# EAGLE design trill.slim (EAGLE 8.4.0)
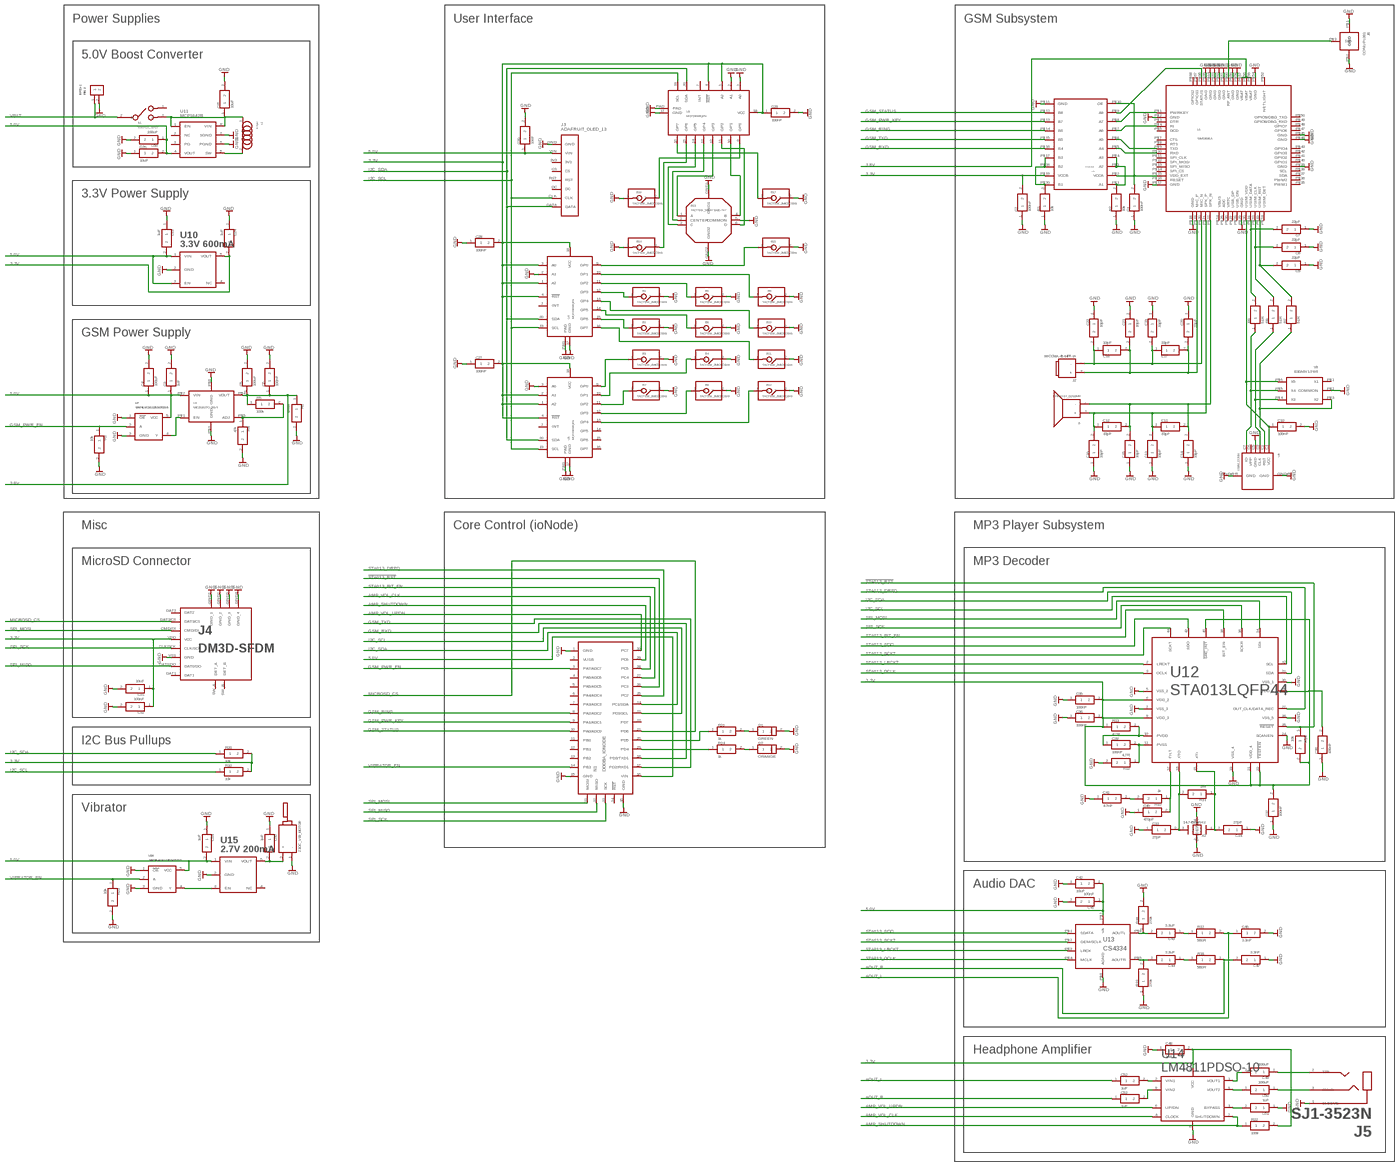
[diagram p0: schematic, sheet 1, overview]
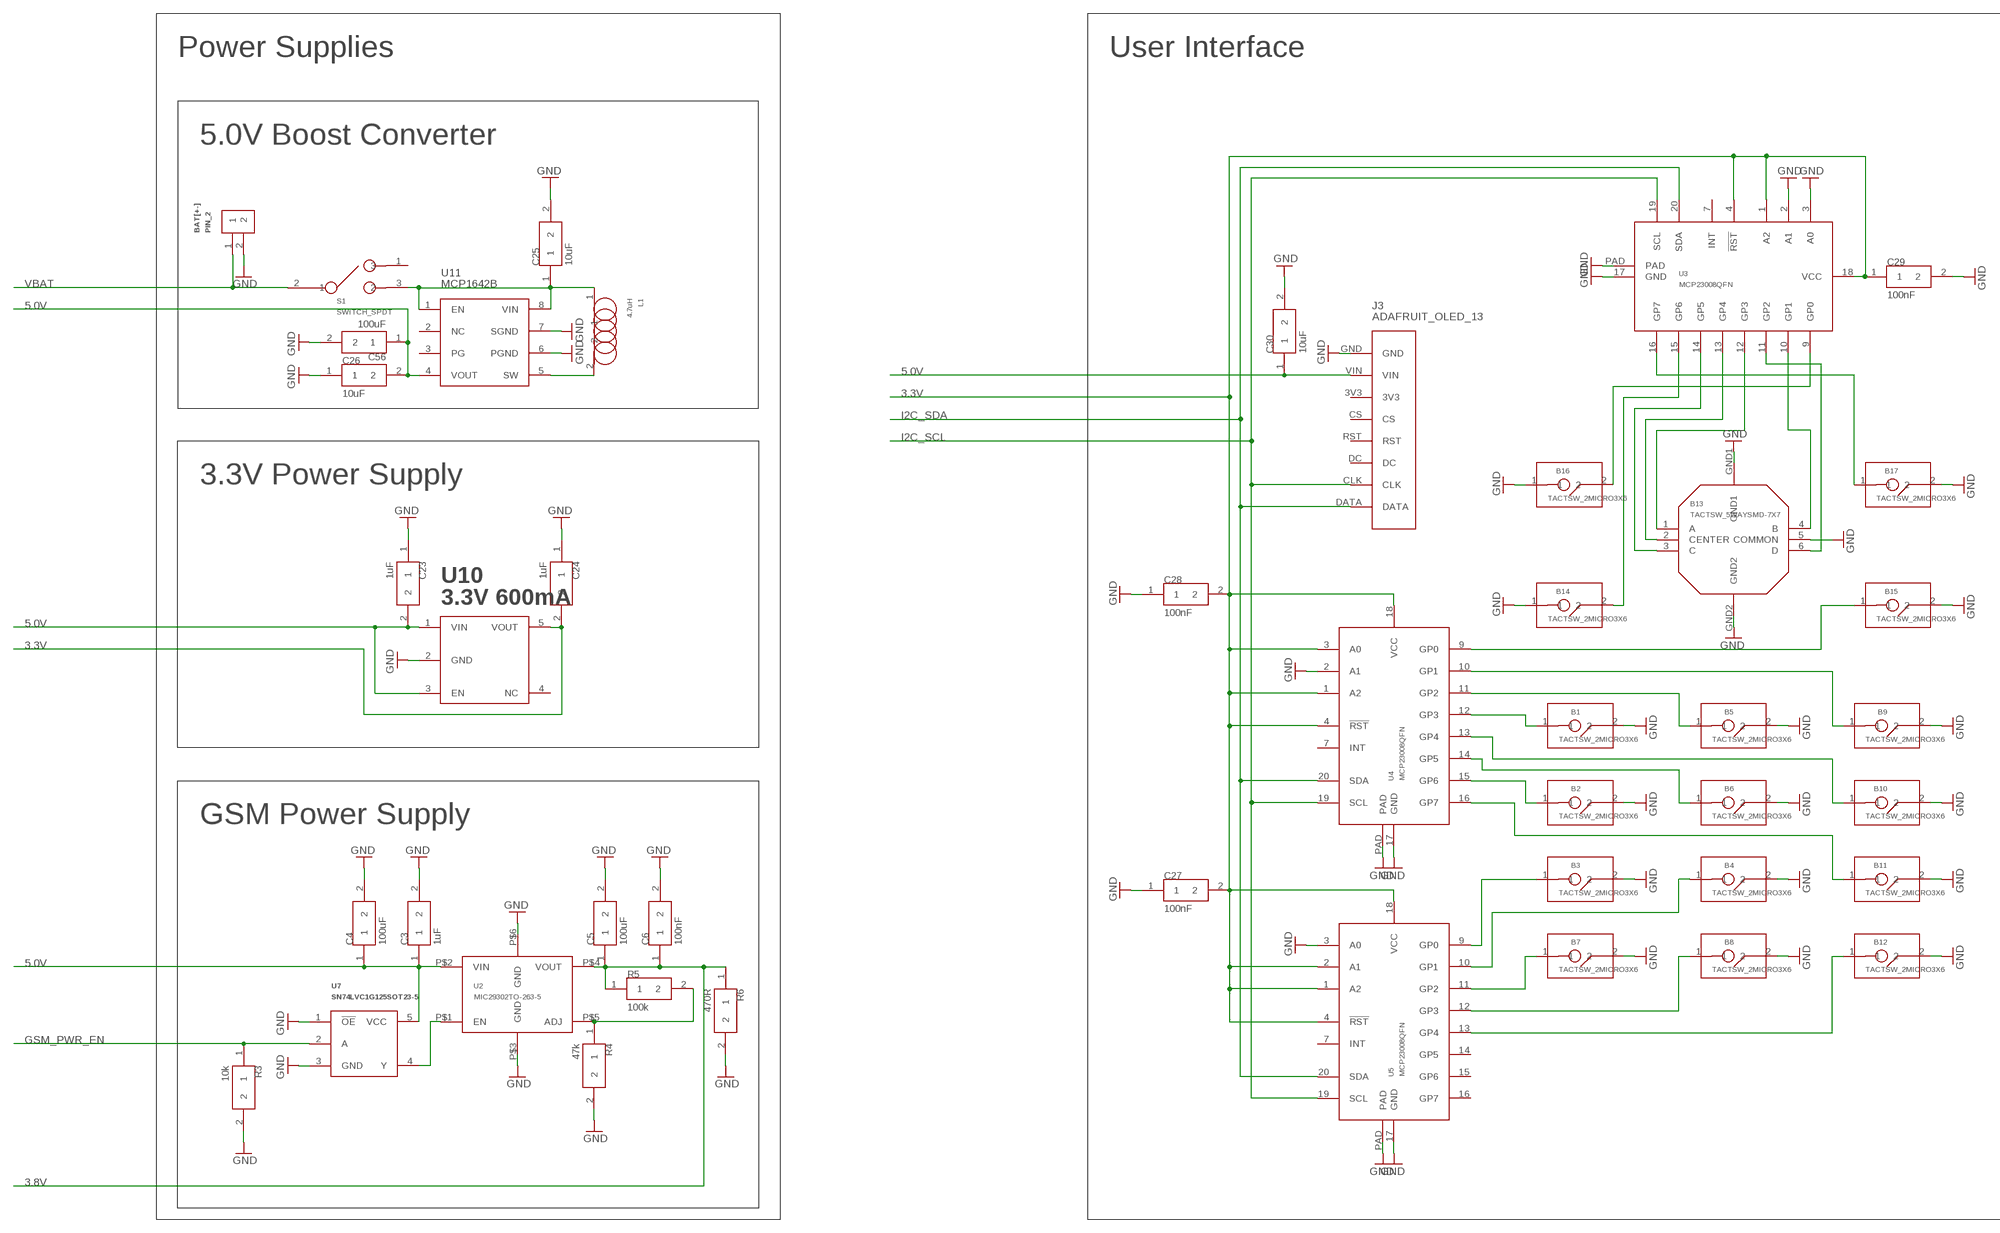
[diagram p1: schematic, sheet 1, part 1 of 4]
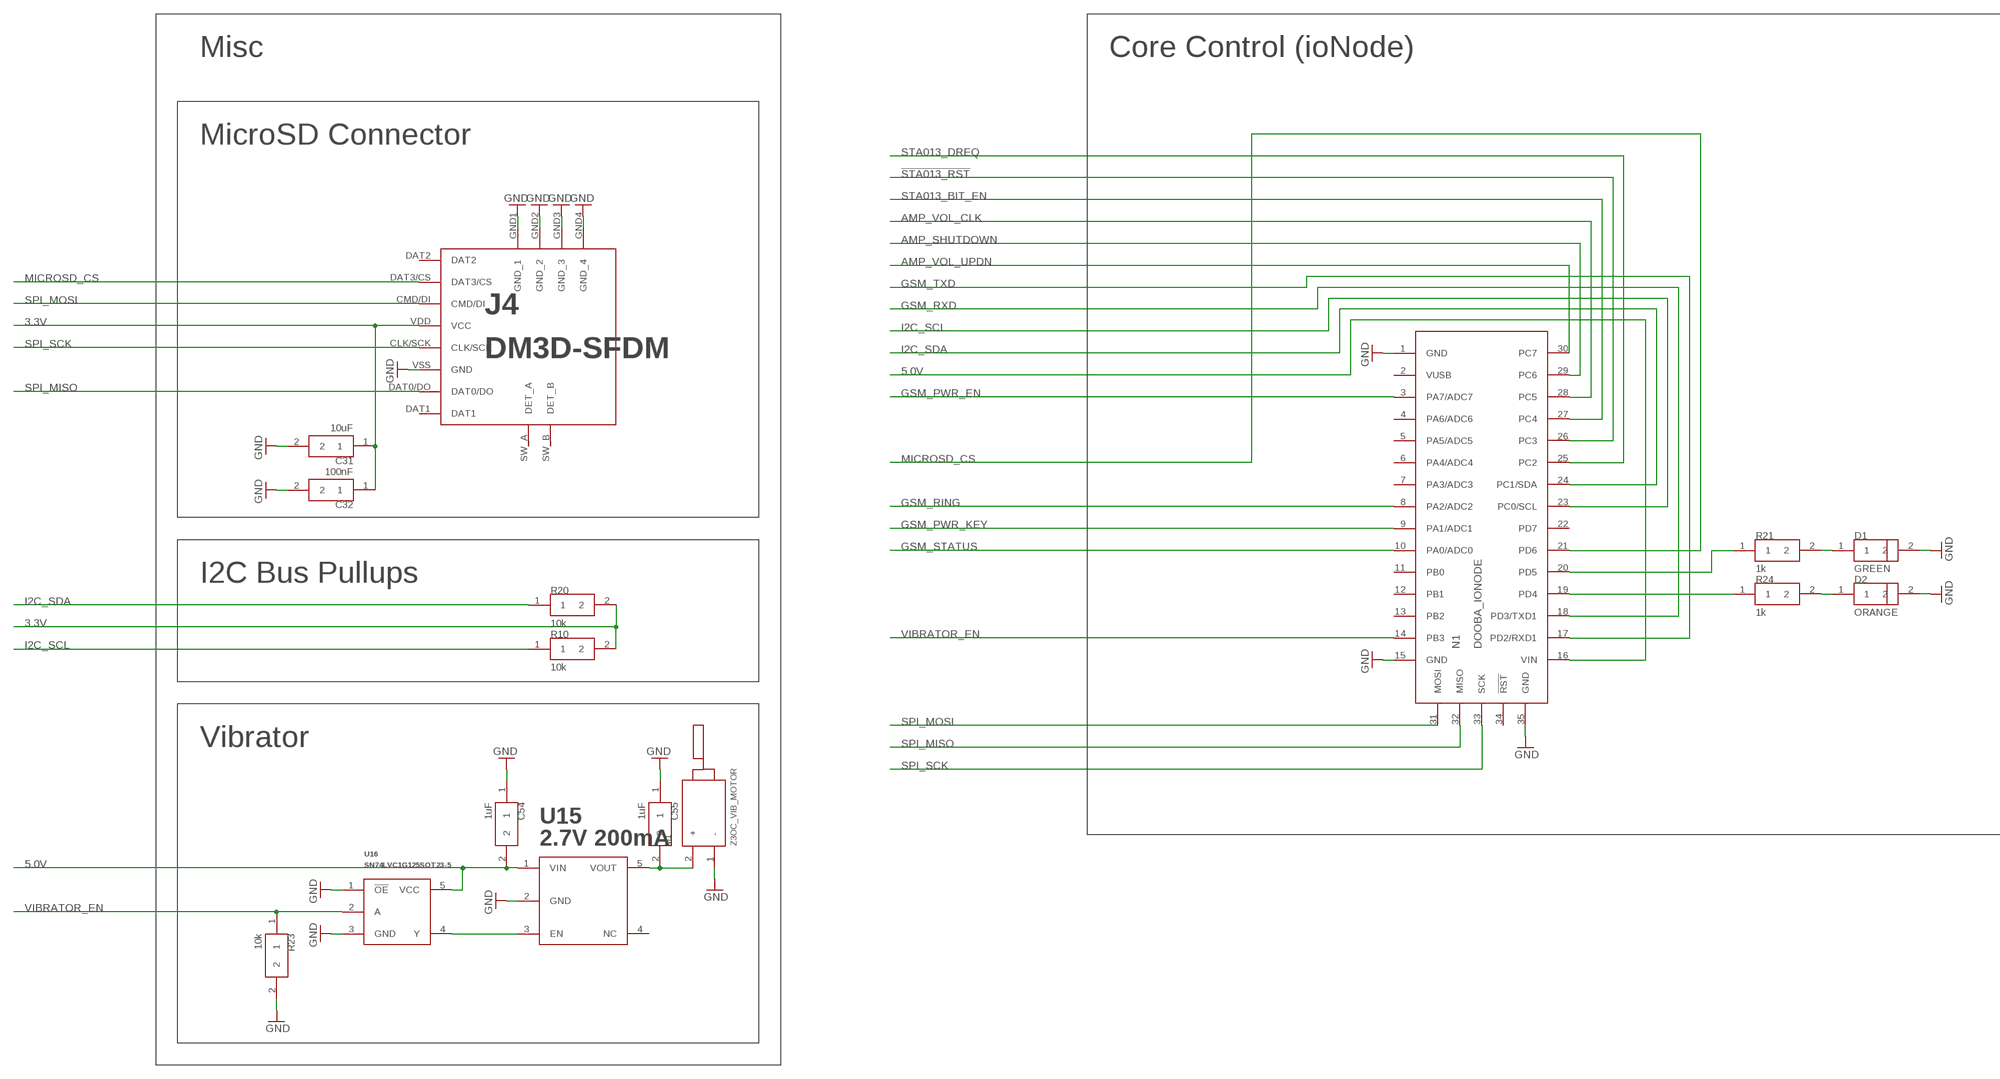
[diagram p2: schematic, sheet 1, part 2 of 4]
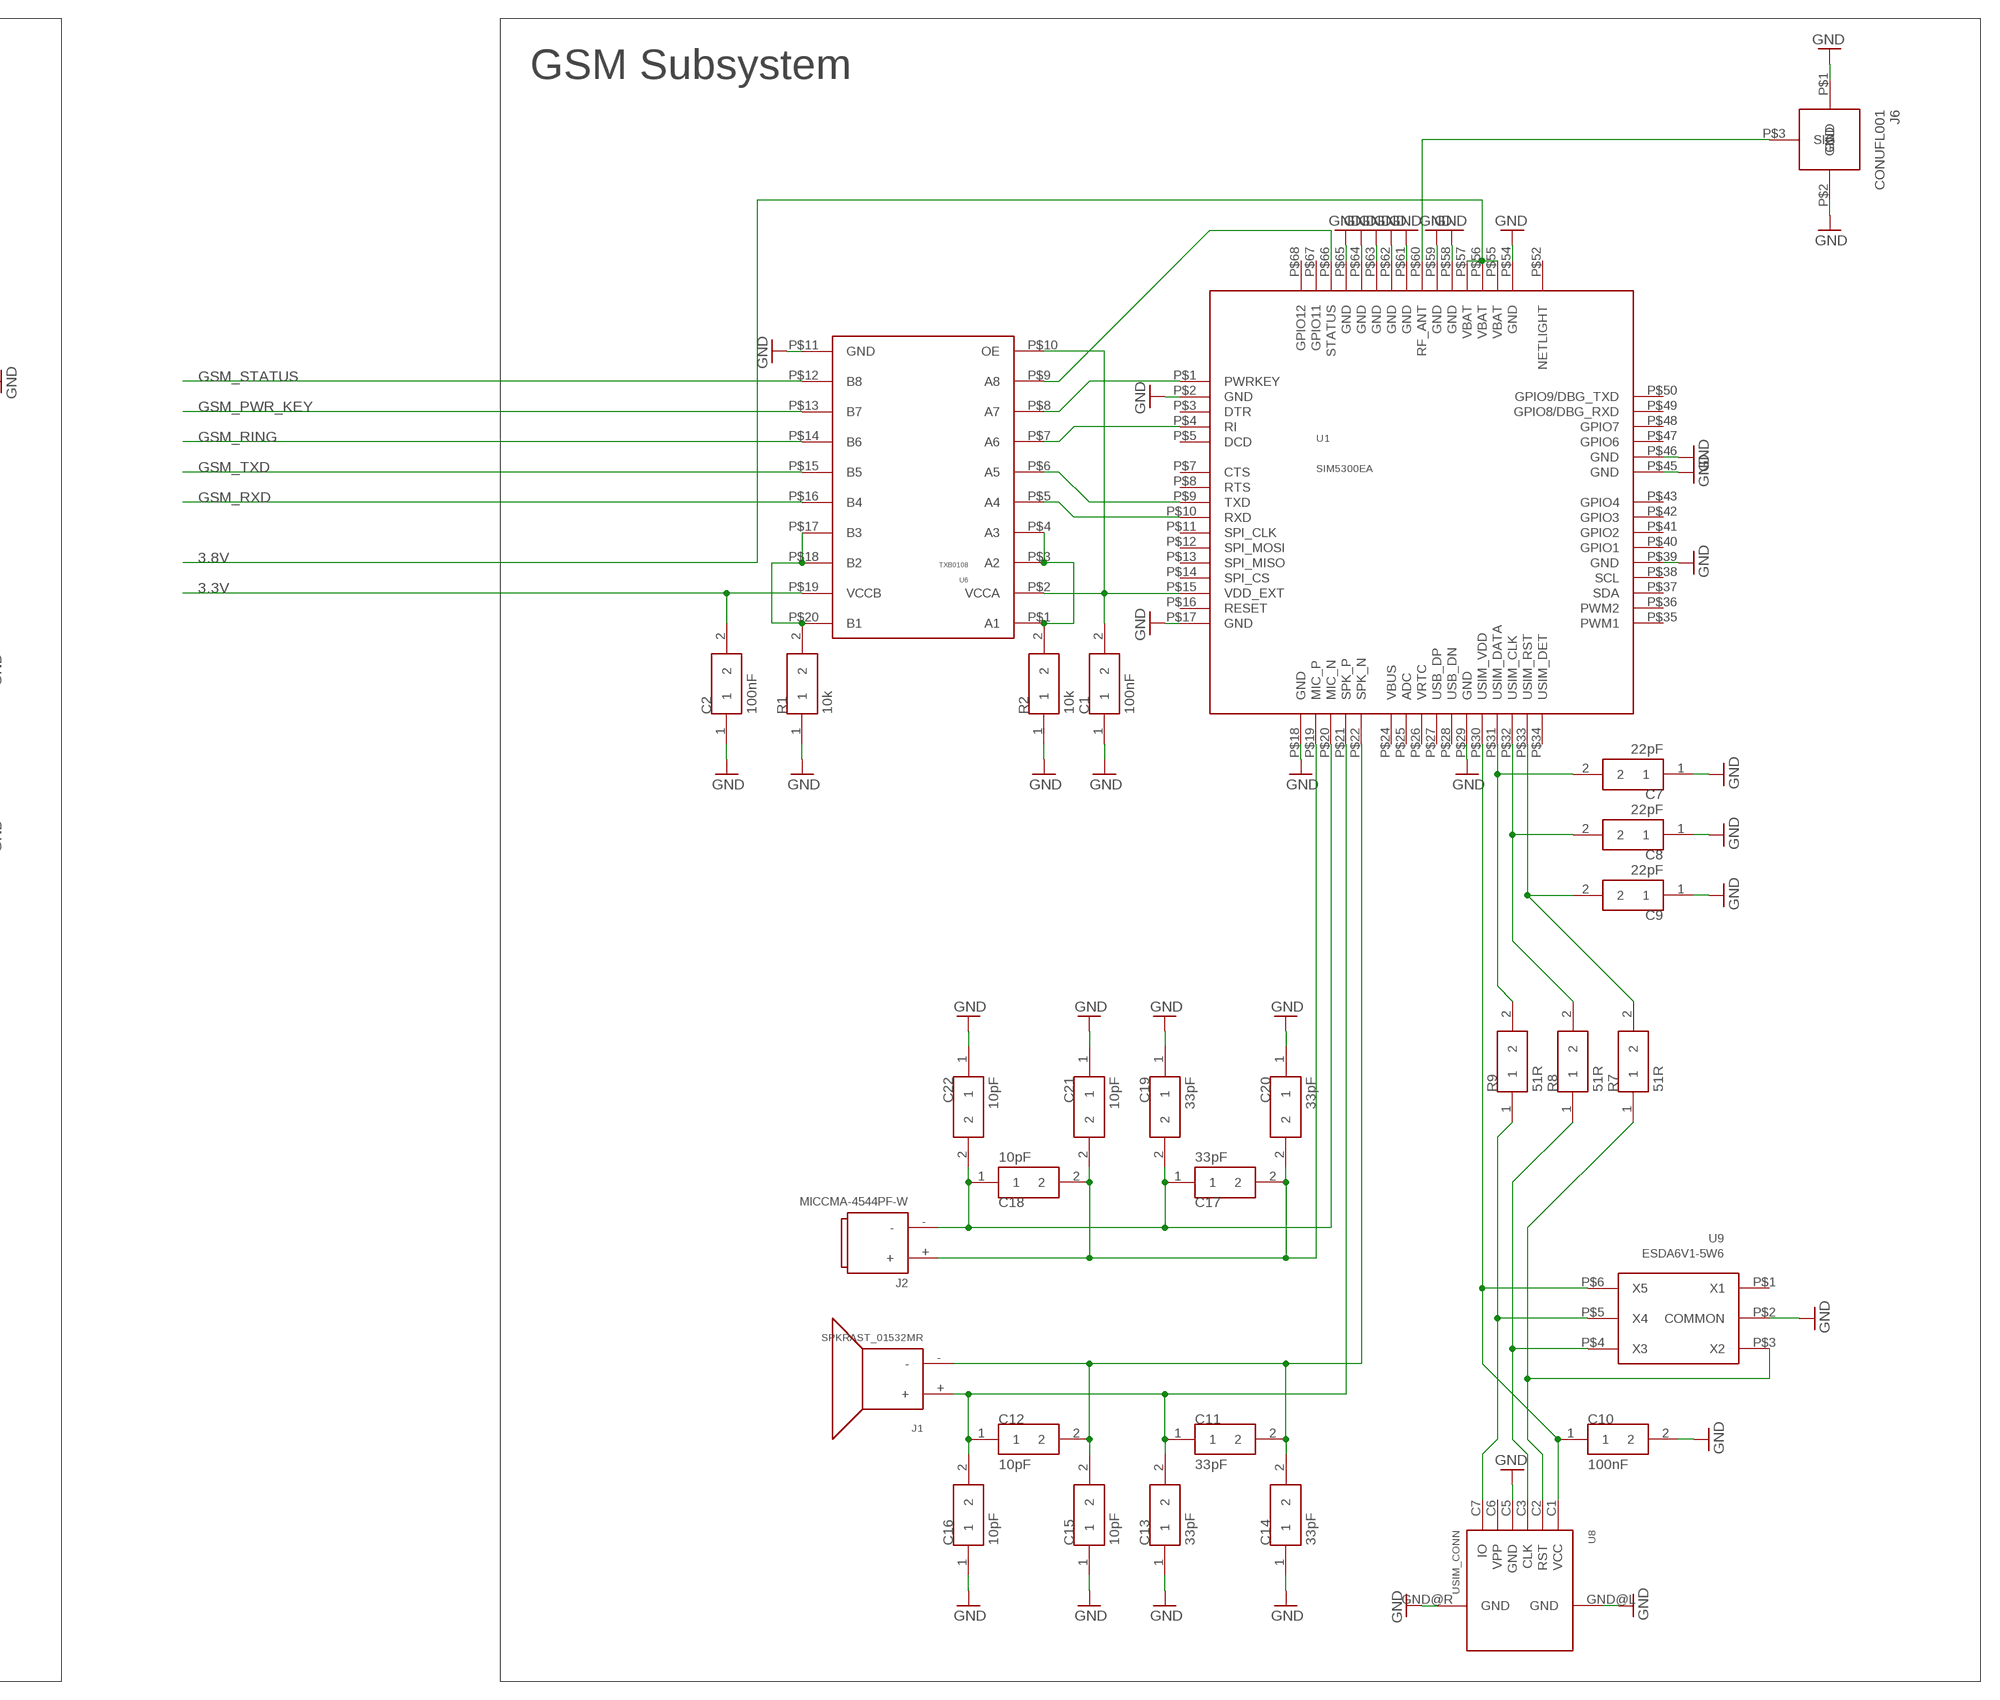
[diagram p3: schematic, sheet 1, part 3 of 4]
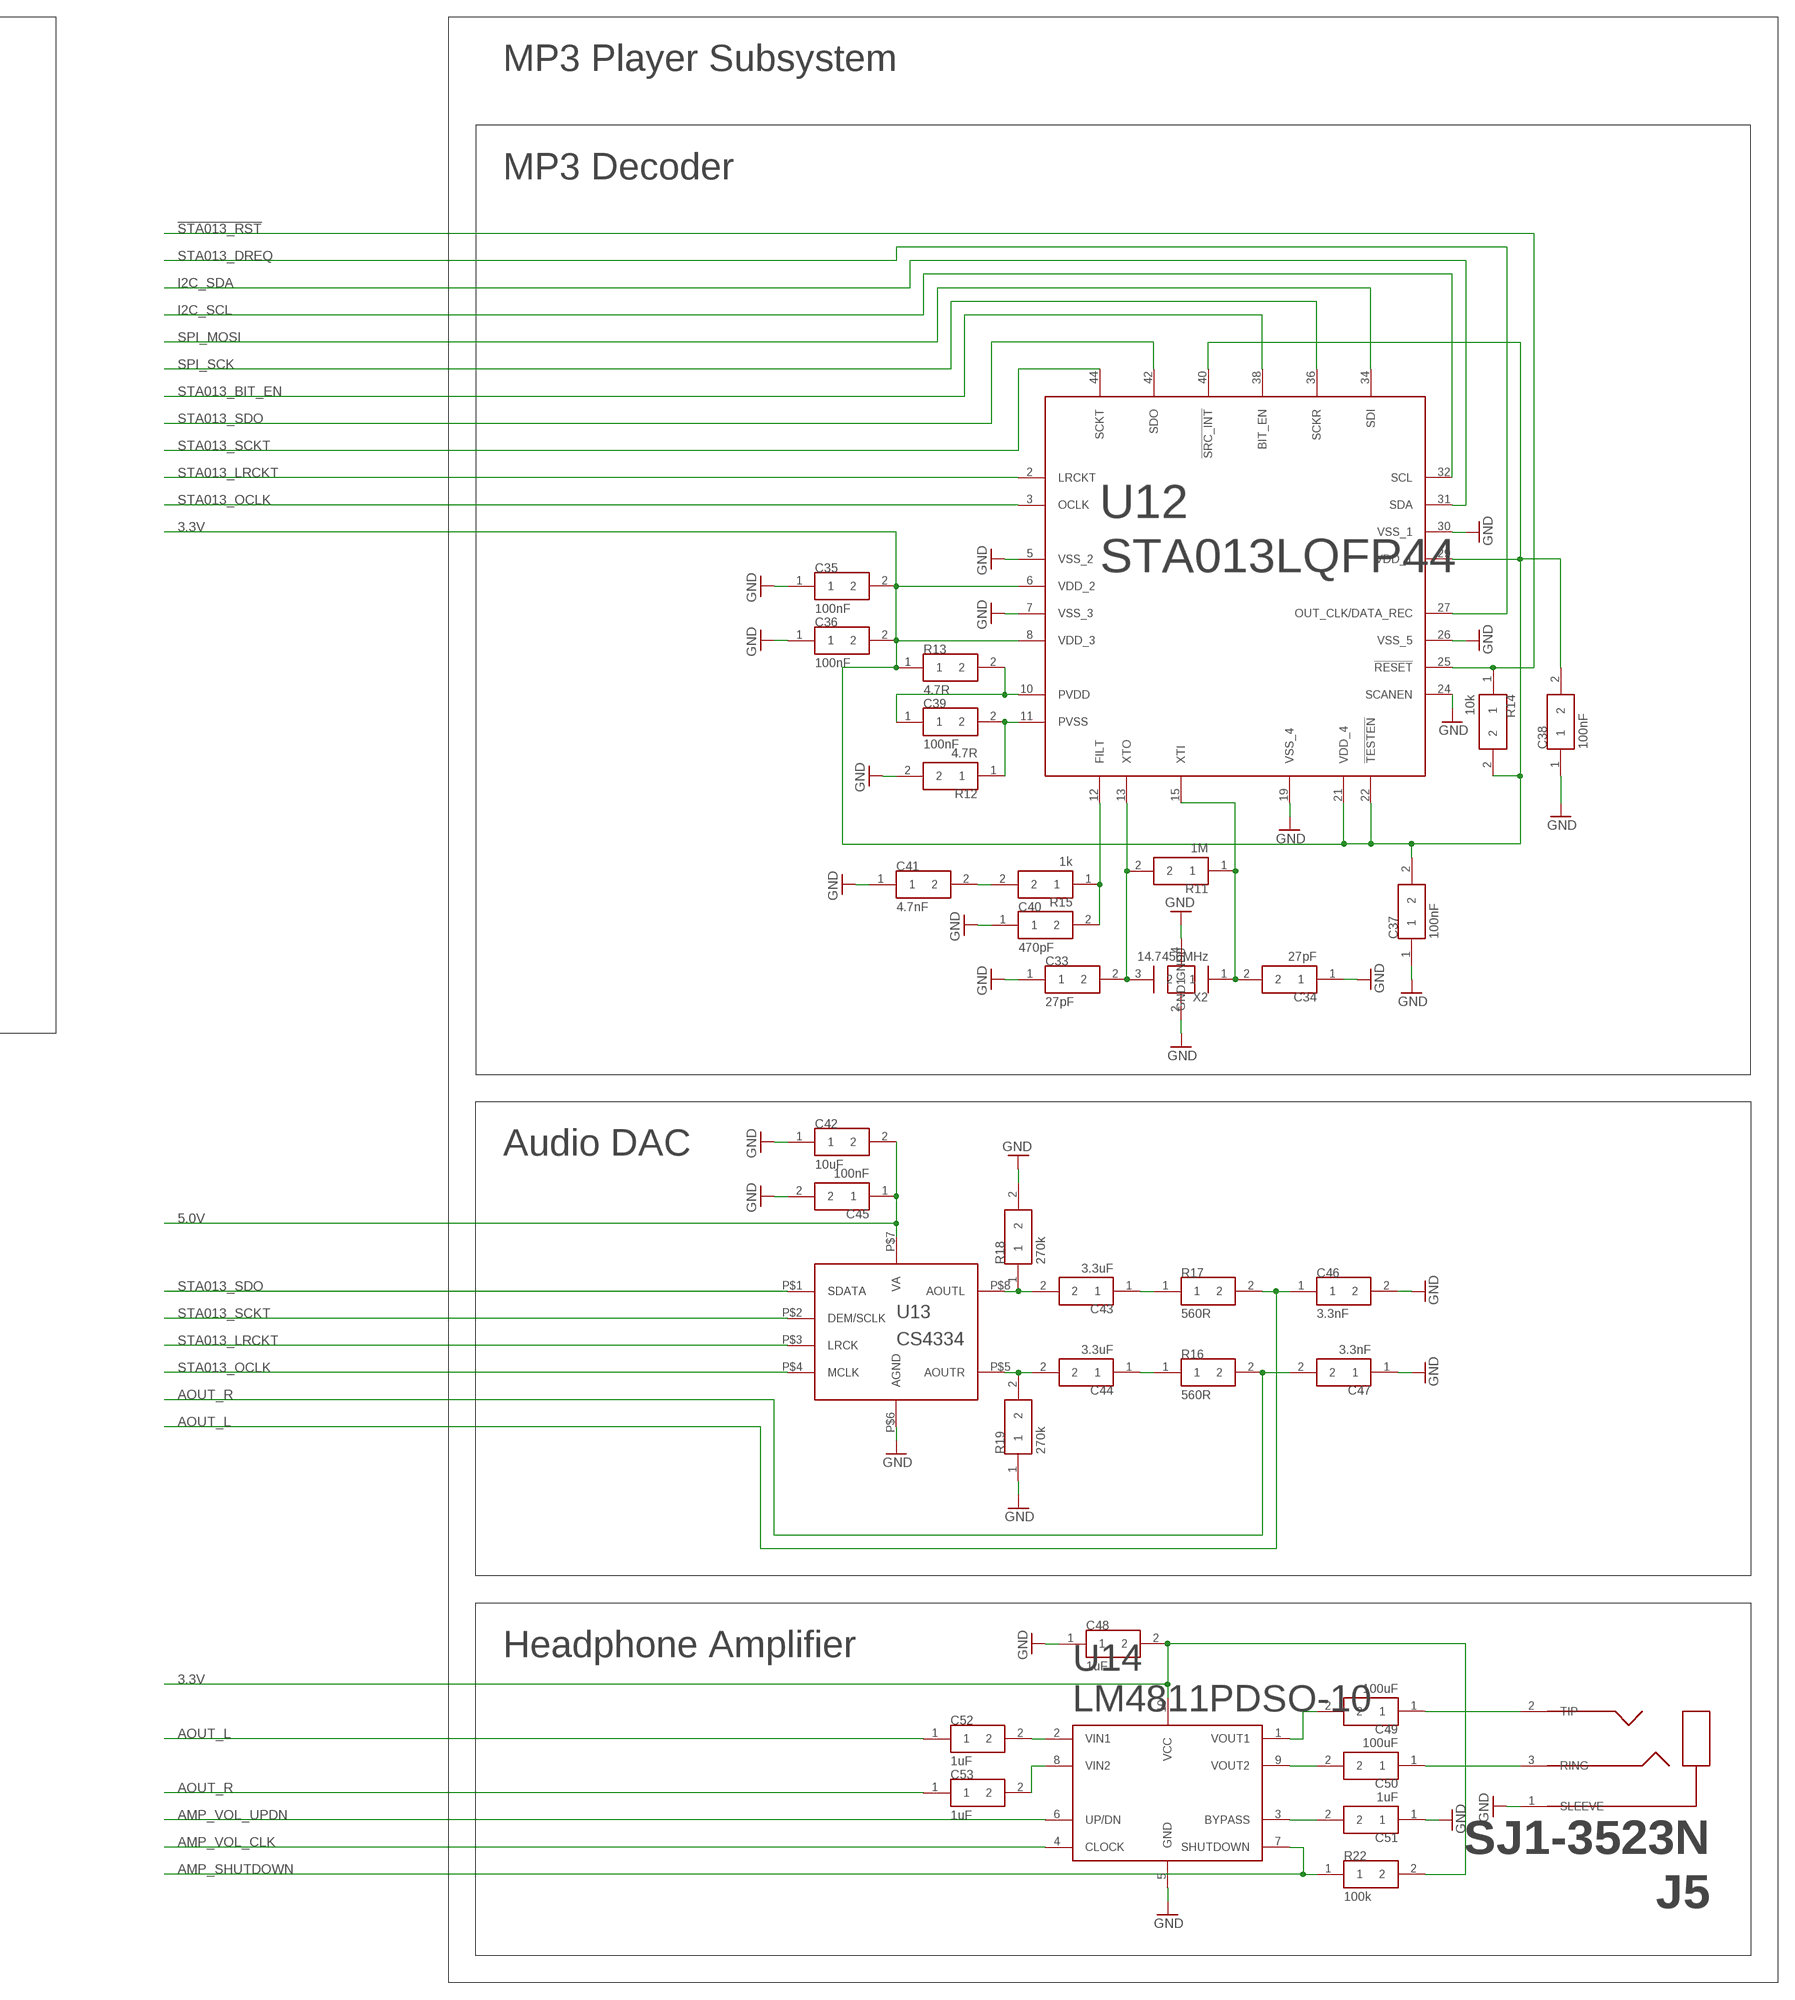
[diagram p4: schematic, sheet 1, part 4 of 4]

## Parts
B1  TACTSW_2MICRO3X6  [TACTSW_MICRO3X6]
B2  TACTSW_2MICRO3X6  [TACTSW_MICRO3X6]
B3  TACTSW_2MICRO3X6  [TACTSW_MICRO3X6]
B4  TACTSW_2MICRO3X6  [TACTSW_MICRO3X6]
B5  TACTSW_2MICRO3X6  [TACTSW_MICRO3X6]
B6  TACTSW_2MICRO3X6  [TACTSW_MICRO3X6]
B7  TACTSW_2MICRO3X6  [TACTSW_MICRO3X6]
B8  TACTSW_2MICRO3X6  [TACTSW_MICRO3X6]
B9  TACTSW_2MICRO3X6  [TACTSW_MICRO3X6]
B10  TACTSW_2MICRO3X6  [TACTSW_MICRO3X6]
B11  TACTSW_2MICRO3X6  [TACTSW_MICRO3X6]
B12  TACTSW_2MICRO3X6  [TACTSW_MICRO3X6]
B13  TACTSW_5WAYSMD-7X7  [TACTSW-5WAY-7X7]
B14  TACTSW_2MICRO3X6  [TACTSW_MICRO3X6]
B15  TACTSW_2MICRO3X6  [TACTSW_MICRO3X6]
B16  TACTSW_2MICRO3X6  [TACTSW_MICRO3X6]
B17  TACTSW_2MICRO3X6  [TACTSW_MICRO3X6]
BAT[+-]  PIN_2  [PIN_2]
C1  100nF  CAP0805  [0805]
C2  100nF  CAP0805  [0805]
C3  1uF  CAP0805  [0805]
C4  100uF  CAP1210  [1210]
C5  100uF  CAP1210  [1210]
C6  100nF  CAP0805  [0805]
C7  22pF  CAP0805  [0805]
C8  22pF  CAP0805  [0805]
C9  22pF  CAP0805  [0805]
C10  100nF  CAP0805  [0805]
C11  33pF  CAP0805  [0805]
C12  10pF  CAP0805  [0805]
C13  33pF  CAP0805  [0805]
C14  33pF  CAP0805  [0805]
C15  10pF  CAP0805  [0805]
C16  10pF  CAP0805  [0805]
C17  33pF  CAP0805  [0805]
C18  10pF  CAP0805  [0805]
C19  33pF  CAP0805  [0805]
C20  33pF  CAP0805  [0805]
C21  10pF  CAP0805  [0805]
C22  10pF  CAP0805  [0805]
C23  1uF  CAP0805  [0805]
C24  1uF  CAP0805  [0805]
C25  10uF  CAP0805  [0805]
C26  10uF  CAP0805  [0805]
C27  100nF  CAP0805  [0805]
C28  100nF  CAP0805  [0805]
C29  100nF  CAP0805  [0805]
C30  10uF  CAP0805  [0805]
C31  10uF  CAP0805  [0805]
C32  100nF  CAP0805  [0805]
C33  27pF  CAP0805  [0805]
C34  27pF  CAP0805  [0805]
C35  100nF  CAP0805  [0805]
C36  100nF  CAP0805  [0805]
C37  100nF  CAP0805  [0805]
C38  100nF  CAP0805  [0805]
C39  100nF  CAP0805  [0805]
C40  470pF  CAP0805  [0805]
C41  4.7nF  CAP0805  [0805]
C42  10uF  CAP0805  [0805]
C43  3.3uF  CAP0805  [0805]
C44  3.3uF  CAP0805  [0805]
C45  100nF  CAP0805  [0805]
C46  3.3nF  CAP0805  [0805]
C47  3.3nF  CAP0805  [0805]
C48  1uF  CAP0805  [0805]
C49  100uF  CAP1210  [1210]
C50  100uF  CAP1210  [1210]
C51  1uF  CAP0805  [0805]
C52  1uF  CAP0805  [0805]
C53  1uF  CAP0805  [0805]
C54  1uF  CAP0805  [0805]
C55  1uF  CAP0805  [0805]
C56  100uF  CAP1210  [1210]
D1  GREEN  LED0805  [0805]
D2  ORANGE  LED0805  [0805]
J1  SPKRAST_01532MR  [SPKR_AST_01532MR]
J2  MICCMA-4544PF-W  [MIC_CMA-4544PF-W]
J3  ADAFRUIT_OLED_13  [ADAFRUIT_OLED_13]
J4  DM3D-SFDM  [DM3D-SF]
J5  SJ1-3523N  [SJ1-352XN]
J6  CONUFL001  [CONUFL001]
L1  4.7uH  IND2520  [2520]
M1  Z3OC_VIB_MOTOR  [Z3OC_VIB_MOTOR]
N1  DOOBA_IONODE  [DOOBA_IONODE]
R1  10k  RES0805  [0805]
R2  10k  RES0805  [0805]
R3  10k  RES0805  [0805]
R4  47k  RES0805  [0805]
R5  100k  RES0805  [0805]
R6  470R  RES0805  [0805]
R7  51R  RES0805  [0805]
R8  51R  RES0805  [0805]
R9  51R  RES0805  [0805]
R10  10k  RES0805  [0805]
R11  1M  RES0805  [0805]
R12  4.7R  RES0805  [0805]
R13  4.7R  RES0805  [0805]
R14  10k  RES0805  [0805]
R15  1k  RES0805  [0805]
R16  560R  RES0805  [0805]
R17  560R  RES0805  [0805]
R18  270k  RES0805  [0805]
R19  270k  RES0805  [0805]
R20  10k  RES0805  [0805]
R21  1k  RES0805  [0805]
R22  100k  RES0805  [0805]
R23  10k  RES0805  [0805]
R24  1k  RES0805  [0805]
S1  SWITCH_SPDT  [JS102011]
U1  SIM5300EA  [SIM5300]
U2  MIC29302TO-263-5  [TO-263]
U3  MCP23008QFN  [20-VQFN]
U4  MCP23008QFN  [20-VQFN]
U5  MCP23008QFN  [20-VQFN]
U6  TXB0108  [TSSOP-20]
U7  SN74LVC1G125SOT23-5  [SOT23-5]
U8  USIM_CONN  [WE_USIM_HINGE]
U9  ESDA6V1-5W6  [SOT-323-6L]
U10  3.3V 600mA  LP3985SOT23-5  [SOT23-5]
U11  MCP1642B  [MSOP8]
U12  STA013LQFP44  [QFP44]
U13  CS4334  [SO8]
U14  LM4811PDSO-10  [PDSO-10]
U15  2.7V 200mA  LP3985SOT23-5  [SOT23-5]
U16  SN74LVC1G125SOT23-5  [SOT23-5]
X2  14.7456MHz  XTAL_GNDSMD_3225  [XTAL_3225]

## Nets
2.7V: C55.2 M1.2(+) U15.5(VOUT)
3.3V: C2.2 C24.2 C27.2 C28.2 C29.1 C31.1 C32.1 C35.2 C36.2 C37.2 C38.2 C48.2 J4.VDD(VCC) R10.2 R13.1 R14.2 R20.2 R22.2 U3.1(A2) U3.4(!RST) U3.18(VCC) U4.1(A2) U4.3(A0) U4.4(!RST) U4.18(VCC) U5.1(A2) U5.2(A1) U5.4(!RST) U5.18(VCC) U6.P$19(VCCB) U10.5(VOUT) U12.6(VDD_2) U12.8(VDD_3) U12.21(VDD_4) U12.22(!TESTEN) U12.29(VDD_1) U12.40(!SRC_INT) U14.10(VCC)
3.8V: C5.1 C6.1 R5.1 R6.1 U1.P$55(VBAT) U1.P$56(VBAT) U1.P$57(VBAT) U2.P$4(VOUT)
5.0V: C3.1 C4.1 C23.2 C26.2 C30.1 C42.2 C45.1 C54.2 C56.1 J3.VIN N1.16(VIN) U2.P$2(VIN) U7.5(VCC) U10.1(VIN) U10.3(EN) U11.4(VOUT) U13.P$7(VA) U15.1(VIN) U16.5(VCC)
!STA013_RST: N1.26(PC3) R14.1 U12.25(!RESET)
AMP_SHUTDOWN: N1.29(PC6) R22.1 U14.7(SHUTDOWN)
AMP_VOL_CLK: N1.28(PC5) U14.4(CLOCK)
AMP_VOL_UPDN: N1.30(PC7) U14.6(UP/DN)
AOUT_L: C46.1 C52.1 R17.2
AOUT_R: C47.2 C53.1 R16.2
GND: B1.2 B2.2 B3.2 B4.2 B5.2 B6.2 B7.2 B8.2 B9.2 B10.2 B11.2 B12.2 B13.5(COMMON) B13.GND1 B13.GND2 B14.1 B15.2 B16.1 B17.2 BAT[+-].2 C1.1 C2.1 C3.2 C4.2 C5.2 C6.2 C7.1 C8.1 C9.1 C10.2 C13.1 C14.1 C15.1 C16.1 C19.1 C20.1 C21.1 C22.1 C23.1 C24.1 C25.2 C26.1 C27.1 C28.1 C29.2 C30.2 C31.2 C32.2 C33.1 C34.1 C35.1 C36.1 C37.1 C38.1 C40.1 C41.1 C42.1 C45.2 C46.2 C47.1 C48.1 C51.1 C54.1 C55.1 C56.2 D1.2 D2.2 J3.GND J4.GND1(GND_1) J4.GND2(GND_2) J4.GND3(GND_3) J4.GND4(GND_4) J4.VSS(GND) J5.1(SLEEVE) J6.P$1(GND) J6.P$2(GND) M1.1(-) N1.1(GND) N1.15(GND) N1.35(GND) R1.1 R2.1 R3.2 R4.2 R6.2 R12.2 R18.2 R19.1 R23.2 U1.P$2(GND) U1.P$17(GND) U1.P$18(GND) U1.P$29(GND) U1.P$39(GND) U1.P$45(GND) U1.P$46(GND) U1.P$54(GND) U1.P$58(GND) U1.P$59(GND) U1.P$61(GND) U1.P$62(GND) U1.P$63(GND) U1.P$64(GND) U1.P$65(GND) U2.P$3(GND) U2.P$6(GND) U3.2(A1) U3.3(A0) U3.17(GND) U3.PAD U4.2(A1) U4.17(GND) U4.PAD U5.3(A0) U5.17(GND) U5.PAD U6.P$11(GND) U7.1(!OE) U7.3(GND) U8.C5(GND) U8.GND@L(GND) U8.GND@R(GND) U9.P$2(COMMON) U10.2(GND) U11.6(PGND) U11.7(SGND) U12.5(VSS_2) U12.7(VSS_3) U12.19(VSS_4) U12.24(SCANEN) U12.26(VSS_5) U12.30(VSS_1) U13.P$6(AGND) U14.5(GND) U15.2(GND) U16.1(!OE) U16.3(GND) X2.2(GND0) X2.4(GND1)
GSM_PWR_EN: N1.3(PA7/ADC7) R3.1 U7.2(A)
GSM_PWR_KEY: N1.9(PA1/ADC1) U6.P$13(B7)
GSM_RING: N1.8(PA2/ADC2) U6.P$14(B6)
GSM_RXD: N1.18(PD3/TXD1) U6.P$16(B4)
GSM_STATUS: N1.10(PA0/ADC0) U6.P$12(B8)
GSM_TXD: N1.17(PD2/RXD1) U6.P$15(B5)
I2C_SCL: J3.CLK N1.23(PC0/SCL) R10.1 U3.19(SCL) U4.19(SCL) U5.19(SCL) U12.32(SCL)
I2C_SDA: J3.DATA N1.24(PC1/SDA) R20.1 U3.20(SDA) U4.20(SDA) U5.20(SDA) U12.31(SDA)
MICROSD_CS: J4.DAT3/CS N1.21(PD6)
N$1: B13.4(B) U3.10(GP1)
N$2: B13.1(A) U3.12(GP3)
N$3: B13.2(CENTER) U3.13(GP4)
N$4: B13.3(C) U3.14(GP5)
N$5: B13.6(D) U3.11(GP2)
N$6: B14.2 U3.15(GP6)
N$7: B16.2 U3.9(GP0)
N$8: B17.1 U3.16(GP7)
N$9: B15.1 U4.9(GP0)
N$10: B9.1 U4.10(GP1)
N$11: B5.1 U4.11(GP2)
N$12: B1.1 U4.12(GP3)
N$13: B10.1 U4.13(GP4)
N$14: B6.1 U4.14(GP5)
N$15: B2.1 U4.15(GP6)
N$16: B11.1 U4.16(GP7)
N$17: B3.1 U5.9(GP0)
N$18: B4.1 U5.10(GP1)
N$19: B7.1 U5.11(GP2)
N$20: B8.1 U5.12(GP3)
N$21: B12.1 U5.13(GP4)
N$22: C1.2 U1.P$15(VDD_EXT) U6.P$2(VCCA) U6.P$10(OE)
N$23: U1.P$66(STATUS) U6.P$9(A8)
N$24: U1.P$1(PWRKEY) U6.P$8(A7)
N$25: U1.P$4(RI) U6.P$7(A6)
N$26: U1.P$9(TXD) U6.P$6(A5)
N$27: U1.P$10(RXD) U6.P$5(A4)
N$28: U2.P$1(EN) U7.4(Y)
N$29: R4.1 R5.2 U2.P$5(ADJ)
N$30: R1.2 U6.P$17(B3) U6.P$18(B2) U6.P$20(B1)
N$31: C10.1 U1.P$30(USIM_VDD) U8.C1(VCC) U9.P$6(X5)
N$32: R2.2 U6.P$1(A1) U6.P$3(A2) U6.P$4(A3)
N$33: R9.1 U8.C7(IO) U9.P$5(X4)
N$34: R8.1 U8.C3(CLK) U9.P$4(X3)
N$35: C34.2 R11.1 U12.15(XTI) X2.1
N$36: R7.1 U8.C2(RST) U9.P$3(X2)
N$37: C9.2 R7.2 U1.P$33(USIM_RST)
N$38: C8.2 R8.2 U1.P$32(USIM_CLK)
N$39: C7.2 R9.2 U1.P$31(USIM_DATA)
N$40: C33.2 R11.2 U12.13(XTO) X2.3
N$41: L1.2 U11.5(SW)
N$42: C39.1 R13.2 U12.10(PVDD)
N$43: C11.2 C12.2 C14.2 C15.2 J1.- U1.P$22(SPK_N)
N$44: C11.1 C12.1 C13.2 C16.2 J1.+ U1.P$21(SPK_P)
N$45: C39.2 R12.1 U12.11(PVSS)
N$46: C41.2 R15.2
N$47: C17.2 C18.2 C20.2 C21.2 J2.+ U1.P$19(MIC_P)
N$48: C17.1 C18.1 C19.2 C22.2 J2.- U1.P$20(MIC_N)
N$49: C40.2 R15.1 U12.12(FILT)
N$50: C43.2 R18.1 U13.P$8(AOUTL)
N$51: C44.2 R19.2 U13.P$5(AOUTR)
N$52: C44.1 R16.1
N$53: C43.1 R17.1
N$54: C49.2 U14.1(VOUT1)
N$55: C50.2 U14.9(VOUT2)
N$56: C51.2 U14.3(BYPASS)
N$57: C50.1 J5.3(RING)
N$58: C52.2 U14.2(VIN1)
N$59: C53.2 U14.8(VIN2)
N$60: C49.1 J5.2(TIP)
N$61: J6.P$3(SIG) U1.P$60(RF_ANT)
N$62: U15.3(EN) U16.4(Y)
N$63: D1.1 R21.2
N$64: D2.1 R24.2
N$65: N1.19(PD4) R24.1
N$66: N1.20(PD5) R21.1
SPI_MISO: J4.DAT0/DO N1.32(MISO)
SPI_MOSI: J4.CMD/DI N1.31(MOSI) U12.34(SDI)
SPI_SCK: J4.CLK/SCK N1.33(SCK) U12.36(SCKR)
STA013_BIT_EN: N1.27(PC4) U12.38(BIT_EN)
STA013_DREQ: N1.25(PC2) U12.27(OUT_CLK/DATA_REC)
STA013_LRCKT: U12.2(LRCKT) U13.P$3(LRCK)
STA013_OCLK: U12.3(OCLK) U13.P$4(MCLK)
STA013_SCKT: U12.44(SCKT) U13.P$2(DEM/SCLK)
STA013_SDO: U12.42(SDO) U13.P$1(SDATA)
VBAT: BAT[+-].1 S1.2
VIBRATOR_EN: N1.14(PB3) R23.1 U16.2(A)
VIN: C25.1 L1.1 S1.3 U11.1(EN) U11.8(VIN)
Unconnected: J3.3V3 J3.CS J3.DC J3.RST J4.DAT1 J4.DAT2 J4.SW_A(DET_A) J4.SW_B(DET_B) N1.2(VUSB) N1.4(PA6/ADC6) N1.5(PA5/ADC5) N1.6(PA4/ADC4) N1.7(PA3/ADC3) N1.11(PB0) N1.12(PB1) N1.13(PB2) N1.22(PD7) N1.34(!RST) S1.1 U1.P$3(DTR) U1.P$5(DCD) U1.P$7(CTS) U1.P$8(RTS) U1.P$11(SPI_CLK) U1.P$12(SPI_MOSI) U1.P$13(SPI_MISO) U1.P$14(SPI_CS) U1.P$16(RESET) U1.P$24(VBUS) U1.P$25(ADC) U1.P$26(VRTC) U1.P$27(USB_DP) U1.P$28(USB_DN) U1.P$34(USIM_DET) U1.P$35(PWM1) U1.P$36(PWM2) U1.P$37(SDA) U1.P$38(SCL) U1.P$40(GPIO1) U1.P$41(GPIO2) U1.P$42(GPIO3) U1.P$43(GPIO4) U1.P$47(GPIO6) U1.P$48(GPIO7) U1.P$49(GPIO8/DBG_RXD) U1.P$50(GPIO9/DBG_TXD) U1.P$52(NETLIGHT) U1.P$67(GPIO11) U1.P$68(GPIO12) U3.7(INT) U4.7(INT) U5.7(INT) U5.14(GP5) U5.15(GP6) U5.16(GP7) U8.C6(VPP) U9.P$1(X1) U10.4(NC) U11.2(NC) U11.3(PG) U15.4(NC)

## Notes on the sheet
- Power Supplies | User Interface | GSM Subsystem
- 5.0V Boost Converter
- 3.3V Power Supply
- GSM Power Supply
- Misc | Core Control (ioNode) | MP3 Player Subsystem
- MicroSD Connector | MP3 Decoder
- I2C Bus Pullups
- Vibrator
- Audio DAC
- Headphone Amplifier

## Library data of the parts
B1-B12 B14-B17 = dooba:TACTSW_2
B13 = dooba:TACTSW_5WAY
BAT[+-] = dooba:PIN_2
C1-C56 = dooba:CAP
D1 D2 = dooba:LED
J1 = dooba:SPKR
J2 = dooba:MIC
J3 = dooba:ADAFRUIT_OLED_13
J4 = dooba:DM3D-SF
J5 = dooba:SJ1-3523N
J6 = dooba:CONUFL001
L1 = dooba:IND
M1 = dooba:Z3OC_VIB_MOTOR
N1 = dooba:DOOBA_IONODE
R1-R24 = dooba:RES
S1 = dooba:SWITCH_SPDT
U1 = dooba:SIM5300EA
U2 = dooba:MIC29302
U3-U5 = dooba:MCP23008
U6 = dooba:TXB0108
U7 U16 = dooba:SN74LVC1G125
U8 = dooba:USIM_CONN
U9 = dooba:ESDA6V1-5W6
U10 U15 = dooba:LP3985
U11 = dooba:MCP1642B
U12 = dooba:STA013
U13 = dooba:CS4334
U14 = dooba:LM4811
X2 = dooba:XTAL_GND

## Board
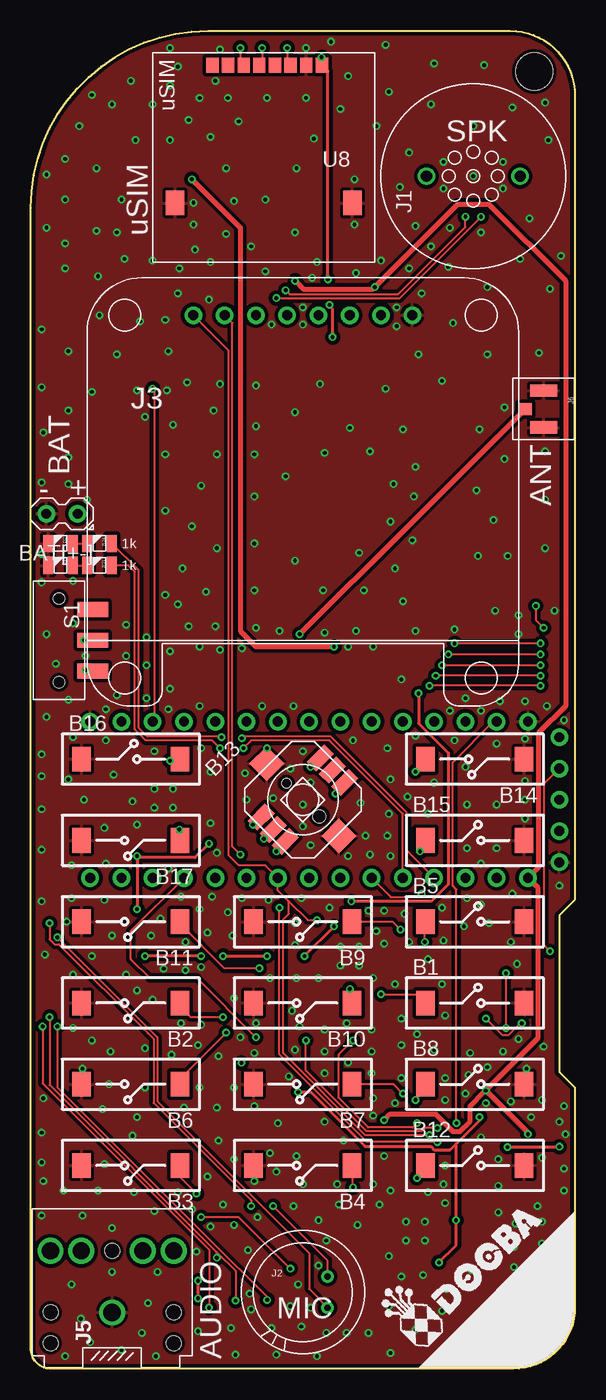
[diagram p5: board, top side]
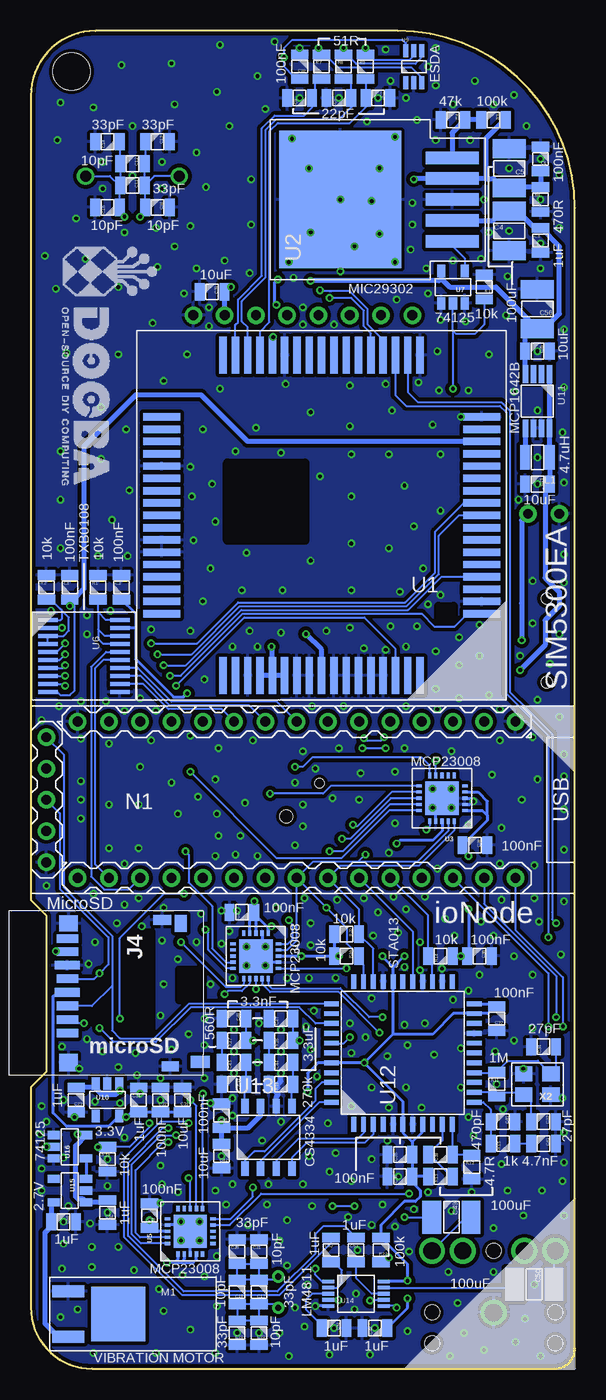
[diagram p6: board, bottom side, seen from below]

Size 44.2 x 108.71 mm. Coordinates in mm from the lower left corner, seen from the top.
Outline: 44.2,22.86 44.2,4.99 arc-90 39.21,0 1.64,0 arc-90 0,1.64 0,94.33 arc-90 14.38,108.71 38.93,108.71 arc-90 44.2,103.44 44.2,38.1 42.93,36.83 42.93,24.13 44.2,22.86
Copper layers (1*16): Top 0.035mm / dielectric 1.5mm / Bottom 0.035mm
Design rules "dooba": minimum track width 6mil, minimum drill 12mil, track to track 6mil, track to pad 6mil, pad to pad 6mil, via to via 6mil, smd to smd 0mil, copper to edge 10mil, drill to drill 10mil, minimum pad ring 10mil, minimum via ring 6mil, stop-mask expansion 2mil, vias tented up to drill 25mil, thermal gap 10mil
Holes 3 mm at 40.89,105.41

### Footprints (pad centres in the part's own frame; a part is rotated, then mirrored left to right if it is on the bottom)
TACTSW_MICRO3X6 = smd 1.5 x 2: 1 -4,0; 2 4,0
TACTSW-5WAY-7X7 = smd 2 x 1.1: 1 -3.4,1.4; 2 -3.4,0; 3 -3.4,-1.4; 4 3.4,1.4; 5 3.4,0; 6 3.4,-1.4 | smd 2 x 2: GND1 0,4.15; GND2 0,-4.15 | hole 0.75: 0,1.9 | hole 1.05: 0,-1.9
PIN_2 = drill 0.8 pad 1.422: 1 -1.27,0; 2 1.27,0
0805 = smd 0.8 x 1.4: 1 -1,0; 2 1,0
1210 = smd 1.524 x 2.678: 1 -1.6,0; 2 1.6,0
SPKR_AST_01532MR = drill 0.9: + 0,3.8; - 0,-3.8
MIC_CMA-4544PF-W = drill 0.5: + 2,1.27; - 2,-1.27
ADAFRUIT_OLED_13 = drill 0.8 pad 1.422: 3V3 3.81,0; CLK -6.35,0; CS 1.27,0; DATA -8.89,0; DC -3.81,0; GND 8.89,0; RST -1.27,0; VIN 6.35,0
DM3D-SF = smd 0.7 x 1.75: CLK/SCK -1.2,-1.34; CMD/DI 1,-1.34; DAT0/DO -3.4,-1.34; DAT1 -4.45,-1.34; DAT2 3.2,-1.34; DAT3/CS 2.1,-1.34 | smd 0.8 x 1.5: GND1 -6,6.36 | smd 0.8 x 1.4: GND2 5.9,7.01 | smd 1.4 x 1.5: GND3 5.6,-1.24 | smd 1.3 x 1.5: GND4 -5.7,-1.24 | smd 1 x 1.55: SW_A 5.55,9.46 | smd 1.4 x 1: SW_B -5.7,7.86 | smd 0.7 x 2.032: VDD -0.1,-1.34; VSS -2.3,-1.34
SJ1-352XN = drill 1.4 pad 2: 1 0,0; 2 5,-5; 3 5,5; 4 5,-2.5; 5 5,2.5 | hole 1.2: 5,0; 0,-5; 0,5; -2.5,5; -2.5,-5
CONUFL001 = smd 1 x 2.2: P$1 -1.5,0; P$2 1.5,0 | smd 1 x 1.05: P$3 0,-1.5
2520 = smd 0.8 x 2: 1 -1,0; 2 1,0
Z3OC_VIB_MOTOR = smd 2.6 x 1: 1 -0.5,1.85; 2 -0.5,-1.85 | smd 4.4 x 4.4: NC 3.55,0
DOOBA_IONODE = drill 0.8 pad 1.422: 1 16.51,6.35; 2 13.97,6.35; 3 11.43,6.35; 4 8.89,6.35; 5 6.35,6.35; 6 3.81,6.35; 7 1.27,6.35; 8 -1.27,6.35; 9 -3.81,6.35; 10 -6.35,6.35; 11 -8.89,6.35; 12 -11.43,6.35; 13 -13.97,6.35; 14 -16.51,6.35; 15 -19.05,6.35; 16 -19.05,-6.35; 17 -16.51,-6.35; 18 -13.97,-6.35; 19 -11.43,-6.35; 20 -8.89,-6.35; 21 -6.35,-6.35; 22 -3.81,-6.35; 23 -1.27,-6.35; 24 1.27,-6.35; 25 3.81,-6.35; 26 6.35,-6.35; 27 8.89,-6.35; 28 11.43,-6.35; 29 13.97,-6.35; 30 16.51,-6.35; 31 -21.59,5.08; 32 -21.59,2.54; 33 -21.59,0; 34 -21.59,-2.54; 35 -21.59,-5.08
JS102011 = smd 1.2 x 2.5: 1 -2.5,2.75; 2 0,2.75; 3 2.5,2.75 | hole 0.9: -3.4,0; 3.4,0
SIM5300 = smd 3 x 0.6: P$1 -13,8; P$2 -13,7; P$3 -13,6; P$4 -13,5; P$5 -13,4; P$6 -13,3; P$7 -13,2; P$8 -13,1; P$9 -13,0; P$10 -13,-1; P$11 -13,-2; P$12 -13,-3; P$13 -13,-4; P$14 -13,-5; P$15 -13,-6; P$16 -13,-7; P$17 -13,-8; P$35 13,-8; P$36 13,-7; P$37 13,-6; P$38 13,-5; P$39 13,-4; P$40 13,-3; P$41 13,-2; P$42 13,-1; P$43 13,0; P$44 13,1; P$45 13,2; P$46 13,3; P$47 13,4; P$48 13,5; P$49 13,6; P$50 13,7; P$51 13,8 | smd 0.6 x 3: P$18 -8,-13; P$19 -7,-13; P$20 -6,-13; P$21 -5,-13; P$22 -4,-13; P$23 -3,-13; P$24 -2,-13; P$25 -1,-13; P$26 0,-13; P$27 1,-13; P$28 2,-13; P$29 3,-13; P$30 4,-13; P$31 5,-13; P$32 6,-13; P$33 7,-13; P$34 8,-13; P$52 8,13; P$53 7,13; P$54 6,13; P$55 5,13; P$56 4,13; P$57 3,13; P$58 2,13; P$59 1,13; P$60 0,13; P$61 -1,13; P$62 -2,13; P$63 -3,13; P$64 -4,13; P$65 -5,13; P$66 -6,13; P$67 -7,13; P$68 -8,13
TO-263 = smd 1.02 x 4.32: P$1 -3.4,-6.8; P$2 -1.7,-6.8; P$3 0,-6.8; P$4 1.7,-6.8; P$5 3.4,-6.8 | smd 11.18 x 9.91: P$6 0,2.305
20-VQFN = smd 0.45 x 0.26: 1 -1.85,1; 2 -1.85,0.5; 3 -1.85,0; 4 -1.85,-0.5; 5 -1.85,-1; 11 1.85,-1; 12 1.85,-0.5; 13 1.85,0; 14 1.85,0.5; 15 1.85,1 | smd 0.26 x 0.45: 6 -1,-1.85; 7 -0.5,-1.85; 8 0,-1.85; 9 0.5,-1.85; 10 1,-1.85; 16 1,1.85; 17 0.5,1.85; 18 0,1.85; 19 -0.5,1.85; 20 -1,1.85 | smd 2.7 x 2.7: PAD 0,0
TSSOP-20 = smd 0.35 x 1.6: P$1 -2.925,-2.925; P$2 -2.275,-2.925; P$3 -1.625,-2.925; P$4 -0.975,-2.925; P$5 -0.325,-2.925; P$6 0.325,-2.925; P$7 0.975,-2.925; P$8 1.625,-2.925; P$9 2.275,-2.925; P$10 2.925,-2.925; P$11 2.925,2.925; P$12 2.275,2.925; P$13 1.625,2.925; P$14 0.975,2.925; P$15 0.325,2.925; P$16 -0.325,2.925; P$17 -0.975,2.925; P$18 -1.625,2.925; P$19 -2.275,2.925; P$20 -2.925,2.925
SOT23-5 = smd 0.66 x 1: 1 0.95,1.315; 2 0,1.315; 3 -0.95,1.315; 4 -0.95,-1.315; 5 0.95,-1.315
WE_USIM_HINGE = smd 1 x 1.2: C1 -4.72,0; C2 -2.18,0; C3 0.36,0; C4 2.9,0; C5 -3.45,0; C6 -0.91,0; C7 1.63,0; C8 4.17,0 | smd 1.5 x 2: GND@L -7.2,11.2; GND@R 7.2,11.2
SOT-323-6L = smd 0.4 x 1.05: P$1 -0.65,-1.3; P$2 0,-1.3; P$3 0.65,-1.3; P$4 0.65,1.3; P$5 0,1.3; P$6 -0.65,1.3
MSOP8 = smd 0.45 x 1.45: 1 -0.975,-2.2; 2 -0.325,-2.2; 3 0.325,-2.2; 4 0.975,-2.2; 5 0.975,2.2; 6 0.325,2.2; 7 -0.325,2.2; 8 -0.975,2.2
QFP44 = smd 1.2 x 0.4: 1 -5.8,4; 2 -5.8,3.2; 3 -5.8,2.4; 4 -5.8,1.6; 5 -5.8,0.8; 6 -5.8,0; 7 -5.8,-0.8; 8 -5.8,-1.6; 9 -5.8,-2.4; 10 -5.8,-3.2; 11 -5.8,-4; 23 5.8,-4; 24 5.8,-3.2; 25 5.8,-2.4; 26 5.8,-1.6; 27 5.8,-0.8; 28 5.8,0; 29 5.8,0.8; 30 5.8,1.6; 31 5.8,2.4; 32 5.8,3.2; 33 5.8,4 | smd 0.4 x 1.2: 12 -4,-5.8; 13 -3.2,-5.8; 14 -2.4,-5.8; 15 -1.6,-5.8; 16 -0.8,-5.8; 17 0,-5.8; 18 0.8,-5.8; 19 1.6,-5.8; 20 2.4,-5.8; 21 3.2,-5.8; 22 4,-5.8; 34 4,5.8; 35 3.2,5.8; 36 2.4,5.8; 37 1.6,5.8; 38 0.8,5.8; 39 0,5.8; 40 -0.8,5.8; 41 -1.6,5.8; 42 -2.4,5.8; 43 -3.2,5.8; 44 -4,5.8
SO8 = smd 0.6 x 1.2: P$1 -1.905,-2.54; P$2 -0.635,-2.54; P$3 0.635,-2.54; P$4 1.905,-2.54; P$5 1.905,2.54; P$6 0.635,2.54; P$7 -0.635,2.54; P$8 -1.905,2.54
PDSO-10 = smd 1 x 0.3: 1 -2.25,1; 2 -2.25,0.5; 3 -2.25,0; 4 -2.25,-0.5; 5 -2.25,-1; 6 2.25,-1; 7 2.25,-0.5; 8 2.25,0; 9 2.25,0.5; 10 2.25,1
XTAL_3225 = smd 1.4 x 1.2: 1 -1.1,-0.85; 2 1.1,-0.85; 3 1.1,0.85; 4 -1.1,0.85

### Placement (x,y rotation side)
B1  36.07,29.72 0 top
B2  8.13,29.72 180 top
B3  8.13,16.51 180 top
B4  22.1,16.51 180 top
B5  36.07,36.32 0 top
B6  8.13,23.11 180 top
B7  22.1,23.11 180 top
B8  36.07,23.11 0 top
B9  22.1,36.32 180 top
B10  22.1,29.72 180 top
B11  8.13,36.32 180 top
B12  36.07,16.51 0 top
B13  22.1,46.23 45 top
B14  36.07,49.53 180 top
B15  36.07,42.93 0 top
B16  8.13,49.53 0 top
B17  8.13,42.93 180 top
BAT[+-]  2.54,69.47 180 top
C1  41.02,63.5 270 bottom
C2  36.83,63.5 270 bottom
C3  2.79,91.69 270 bottom
C4  5.33,92.46 270 bottom
C5  5.33,97.54 90 bottom
C6  2.79,98.3 90 bottom
C7  16,103.25 180 bottom
C8  19.18,103.25 0 bottom
C9  22.35,103.25 0 bottom
C10  22.35,105.79 90 bottom
C11  35.94,96.14 180 bottom
C12  35.94,97.92 180 bottom
C13  33.91,99.69 180 bottom
C14  37.97,99.69 0 bottom
C15  37.97,94.36 0 bottom
C16  33.91,94.36 180 bottom
C17  25.65,6.22 90 bottom
C18  27.43,6.22 90 bottom
C19  27.43,2.92 90 bottom
C20  27.43,9.53 270 bottom
C21  25.65,9.53 270 bottom
C22  25.65,2.92 90 bottom
C23  40.51,21.84 90 bottom
C24  35.43,21.84 270 bottom
C25  3.05,71.88 180 bottom
C26  3.05,82.68 180 bottom
C27  27.05,37.08 0 bottom
C28  8.13,42.55 180 bottom
C29  34.54,12.45 90 bottom
C30  29.46,87.5 180 bottom
C31  31.88,21.84 90 bottom
C32  33.66,21.84 90 bottom
C33  2.54,20.07 180 bottom
C34  2.54,26.16 0 bottom
C35  14.22,17.4 0 bottom
C36  14.22,15.62 0 bottom
C37  6.35,28.45 90 bottom
C38  7.75,33.53 180 bottom
C39  10.92,17.4 0 bottom
C40  5.84,20.07 180 bottom
C41  2.54,18.29 180 bottom
C42  28.7,17.27 90 bottom
C43  27.69,24.89 0 bottom
C44  23.88,24.89 0 bottom
C45  28.7,20.57 90 bottom
C46  27.69,28.45 180 bottom
C47  23.88,28.45 0 bottom
C48  16.26,3.3 0 bottom
C49  10.03,12.32 180 bottom
C50  3.3,6.86 180 bottom
C51  19.56,3.3 180 bottom
C52  19.81,9.65 270 bottom
C53  17.78,9.65 270 bottom
C54  37.97,12.7 90 bottom
C55  41.53,11.94 180 bottom
C56  3.05,86.11 90 bottom
D1  2.41,65.28 180 top
D2  2.41,67.06 180 top
J1  35.94,96.9 90 top
J2  22.1,6.22 0 top
J3  22.1,85.6 0 top
J4  39.88,30.48 270 bottom
J5  6.6,4.57 90 top
J6  41.66,77.98 270 top
L1  3.05,74.04 180 bottom
M1  40.64,4.45 0 bottom
N1  21.34,46.23 0 bottom
R1  38.73,63.5 270 bottom
R2  42.93,63.5 270 bottom
R3  7.37,87.88 90 bottom
R4  9.91,101.47 180 bottom
R5  6.6,101.47 180 bottom
R6  2.79,95 270 bottom
R7  20.57,105.79 270 bottom
R8  18.8,105.79 270 bottom
R9  17.02,105.79 270 bottom
R10  18.54,33.53 180 bottom
R11  6.35,23.11 270 bottom
R12  8.38,16.38 270 bottom
R13  10.92,15.62 0 bottom
R14  10.92,33.53 0 bottom
R15  5.84,18.29 0 bottom
R16  23.88,26.67 0 bottom
R17  27.69,26.67 0 bottom
R18  27.69,23.11 180 bottom
R19  23.88,23.11 0 bottom
R20  18.54,35.31 180 bottom
R21  5.59,65.28 180 top
R22  15.75,9.65 90 bottom
R23  37.97,17.02 270 bottom
R24  5.59,67.06 180 top
S1  2.29,59.18 270 top
U1  20.57,69.34 180 bottom
U2  16.76,95 90 bottom
U3  10.79,46.35 180 bottom
U4  25.91,33.53 270 bottom
U5  31.24,11.18 90 bottom
U6  39.88,57.91 270 bottom
U7  9.91,87.88 180 bottom
U8  18.92,105.92 180 top
U9  13.08,105.79 0 bottom
U10  37.97,21.84 0 bottom
U11  3.05,78.61 180 bottom
U12  13.97,25.65 90 bottom
U13  24.89,18.8 0 bottom
U14  17.78,6.1 0 bottom
U15  41.02,14.48 270 bottom
U16  41.02,18.03 90 bottom
X2  3.05,23.11 180 bottom

### Tracks (layer width: path | path; a pad name or v marks a point on that pad's centre or on a via)
2.7V
  Bottom 0.406: U15.5 42.53,13.34 C55.2 42.53,11.57 43.05,11.05 43.05,3.68 41.97,2.6 M1.2
3.3V  (via drill 0.3)
  Top 0.254: v13.59,5.71 v13.59,7.16 | v33.15,8.64 34.54,10.03 v34.54,12.06 34.54,18.29 | v13.84,33.53 v9.27,33.53 | 8.64,41.53 v8.64,41.66 | 8.64,41.53 v8.64,37.34 | v14.48,42.67 13.34,41.53 8.64,41.53 | v21.72,22.48 22.74,22.48 27.16,18.06 32.51,18.06 32.77,17.8 34.06,17.8 34.54,18.29 | v22.23,33.53 v24.64,35.94 | v15.62,33.53 v19.18,33.53 | v31.5,54.86 31.5,52.45 32.36,51.59 33.91,50.04 33.91,39.37 32.51,37.97 v26.04,37.97 | 34.54,18.29 36.45,20.19 v36.45,20.45
  Bottom 0.254: R13.1 C36.2 | C36.2 C35.2 13.21,17.41 13.21,18.41 | U12.8 12.37,19.25 13.21,18.41 | 13.21,18.41 13.97,19.18 U12.6 13.97,21.72 v17.11,24.85 | C36.2 13.22,15.13 12.57,14.48 12.57,13.97 12.95,13.59 13.84,13.59 15.75,11.68 R22.2 13.59,8.49 v13.59,7.16 13.65,7.1 U14.10 | C48.2 13.59,4.97 v13.59,5.71 | U5.18 34.27,11.18 C29.1 v34.54,12.06 | U5.4 30.74,8.88 30.99,8.64 32,8.64 | 32.51,8.64 32,8.64 | 32.51,8.64 v33.15,8.64 | C31.1 C32.1 C24.2 36.05,20.84 v36.45,20.45 36.94,20.45 U10.5 37.87,19.68 41.27,19.68 42.37,20.78 42.37,30.27 42.06,30.58 J4.VDD | 14.77,32.6 U12.29 14.77,27.19 | 14.77,32.6 v13.84,33.53 | R14.2 v9.27,33.53 8.76,33.53 | 8.76,33.53 C38.2 | U12.22 6.56,29.65 C37.2 | C37.2 | C37.2 6.49,29.46 7.09,28.85 U12.21 9.88,28.85 11.56,27.18 14.76,27.18 14.77,27.19 | v17.11,24.85 U12.40 20.87,24.85 21.72,24 v21.72,22.48 | 14.77,27.19 v17.11,24.85 | v8.64,41.66 9.13,42.15 C28.2 7.11,44.56 7.11,44.96 | v8.64,37.34 8.64,33.66 8.76,33.53 | U3.18 10.79,43.69 11.56,42.93 14.22,42.93 v14.48,42.67 | U3.4 7.87,46.85 7.11,46.1 7.11,44.96 | U3.1 7.51,45.35 7.11,44.96 | R20.2 R10.2 | U4.18 v22.23,33.53 R10.2 | 25.91,36.83 U4.3 | 25.91,36.83 25.91,36.94 25.98,37.01 | 25.98,37.01 C27.2 26.04,37.1 v26.04,37.97 | U4.1 24.91,35.83 24.96,35.88 | 24.96,35.88 25.91,36.83 | v24.64,35.94 24.7,35.88 24.96,35.88 | U4.4 26.41,36.58 25.98,37.01 | 14.77,32.6 15.62,33.45 v15.62,33.53 | R10.2 v19.18,33.53 | U5.2 31.74,8.9 32,8.64 | U5.1 32.24,8.91 32.51,8.64 | C2.2 35.69,61.36 35.69,60.2 | 35.69,60.2 35.7,60.19 U6.P$19 | 35.69,60.2 35.69,57.66 32.59,54.56 31.8,54.56 v31.5,54.86
3.8V  (via drill 0.3)
  Top 0.406: v13.08,96.65 17.02,92.71 17.02,59.94 18.29,58.67 v24.64,58.67
  Bottom 0.406: C6.1 R6.1 5.27,96 C5.1 5.41,96.01 5.97,96.01 6.65,96.7 7.24,96.7 | 7.24,96.7 U2.P$4 13.03,96.7 v13.08,96.65 | R5.1 5.71,101.47 7.24,99.95 7.24,96.7 | U1.P$57 U1.P$56 | U1.P$56 U1.P$55 | U1.P$56 24.57,58.61 v24.64,58.67
5.0V  (via drill 0.3)
  Top 0.406: v28.7,20.19 29.21,20.7 32.87,20.7 34.29,19.28 34.85,19.28 35.69,20.11 35.69,21.34 36.83,22.48 36.96,22.48 v36.96,22.61 | v36.96,22.61 40.39,19.18 v40.39,19.05 | v36.96,22.61 41.17,26.82 41.17,39.09 N1.16 41.22,40.72 41.22,51.64 43.43,53.85 43.43,88.39 37.21,94.61 34.67,94.61 v27.94,87.88 27.79,87.73 22.12,87.73 v21.46,88.39
  Bottom 0.406: C42.2 C45.1 | C45.1 26.53,19.57 25.53,20.57 U13.P$7 | U10.1 37.02,22.67 v36.96,22.61 37.26,22.3 38.45,22.3 38.92,22.78 U10.3 39.24,22.84 C23.2 | C45.1 v28.7,20.19 | C54.2 38.15,13.53 U15.1 39.97,13.79 40.35,13.79 40.56,14 40.56,18.13 U16.5 39.77,19.05 v40.39,19.05 | U11.4 4.02,82.65 C26.2 4.05,84.31 4.06,84.33 3.23,84.33 C56.1 | C56.1 2.49,84.51 1.27,85.72 1.27,91.17 C3.1 3.29,92.69 4.19,93.6 4.88,93.6 C4.1 5.54,93.85 6.1,93.85 6.65,93.3 U2.P$2 | U7.5 10.86,88.58 | 10.86,88.58 10.16,87.88 6.43,87.88 C56.1 | 10.86,88.58 11.04,88.39 v21.46,88.39 | v27.94,87.88 28.08,87.88 C30.1 28.46,85.61 J3.VIN
!STA013_RST
  Bottom 0.152: N1.26 11.92,36.81 R14.1 11.68,33.29 11.68,33.02 11.57,32.91 U12.25
AMP_SHUTDOWN  (via drill 0.3)
  Top 0.152: v1.52,28.57 1.52,23.06 15.11,9.47 | v15.11,9.02 15.11,9.47 | 15.11,9.47 16.64,7.95 v16.64,5.54
  Bottom 0.152: N1.29 7.37,37.77 1.52,31.93 v1.52,28.57 | v15.11,9.02 15.48,8.65 R22.1 | v16.64,5.54 16.58,5.6 U14.7
AMP_VOL_CLK  (via drill 0.3)
  Top 0.152: v2.16,27.81 2.16,22.86 14.22,10.79 19.43,5.59 19.42,5.6 v19.2,5.6
  Bottom 0.152: N1.28 2.16,32.13 v2.16,27.81 | v19.2,5.6 U14.4
AMP_VOL_UPDN  (via drill 0.3)
  Top 0.152: v0.97,27.81 0.97,23.19 14.48,9.68 v14.48,4.95
  Bottom 0.152: N1.30 4.83,35.66 0.97,31.8 v0.97,27.81 | v14.48,4.95 14.62,5.1 U14.6
AOUT_L  (via drill 0.3)
  Top 0.152: v31.37,19.96 31.02,19.61 27.4,19.61 25.02,21.99 25.02,25.53 v26.16,26.67
  Bottom 0.152: C46.1 R17.2 v26.16,26.67 | C52.1 19.81,10.19 24.03,5.97 31.9,5.97 36.6,10.67 36.6,17.15 33.63,20.12 31.52,20.12 v31.37,19.96
AOUT_R  (via drill 0.3)
  Top 0.152: v22.35,26.67 22.35,24.23 27.28,19.3 31.75,19.3 32,19.56 v33.02,19.56
  Bottom 0.152: C47.2 R16.2 v22.35,26.67 | C53.1 18.68,11.56 20.45,11.56 21.08,10.92 21.08,9.35 24.16,6.27 31.77,6.27 36.3,10.8 36.3,16.74 33.48,19.56 v33.02,19.56
GND  (via drill 0.3)
  Bottom 0.152: U3.PAD v10.03,45.59 | U5.PAD v32,11.94 | U4.PAD v25.15,32.77
  Bottom 0.254: U3.17 11.29,45.33 v11.56,45.59 | U3.2 8.5,45.85 v8.26,46.1 8.51,46.35 U3.3 | U4.17 25.41,33.03 U4.PAD 25.41,34.03 U4.2 | U14.5 21.07,5.1 v21.08,5.08 | U5.3 U5.PAD 31.74,11.68 U5.17
  Bottom 0.406: U13.P$6 24.26,22.1 24.13,22.23 24.13,22.35 24.51,22.73 24.26,22.73 24.13,22.86 24.38,23.11 R19.1 24.13,23.11 23.88,23.37 v23.88,24
  other vias: 8.13,104.65 15.37,107.19 16,103.25 14.99,104.65 13.72,103.25 11.94,105.79 19.18,103.25 22.35,103.25 16.89,101.35 24.38,107.82 11.3,107.31 11.3,104.27 25.15,102.36 25.78,105.03 28.83,107.57 29.08,103.76 32.77,106.05 32.51,102.74 28.07,100.97 26.29,96.65 30.73,98.81 22.99,99.95 14.61,100.08 14.61,89.92 23.24,89.92 19.05,95 21.59,97.54 15.88,97.54 21.46,92.33 15.88,92.2 16.51,94.87 17.91,91.19 19.05,89.15 22.86,88.65 26.29,92.96 26.42,89.03 28.45,90.04 31.24,92.84 33.53,95.89 29.97,96.01 34.04,92.71 30.73,89.41 32.51,91.19 36.58,92.33 33.91,89.53 39.75,90.17 37.08,87.88 34.29,84.96 42.16,87.76 43.05,90.42 40.51,93.47 38.35,95.89 38.35,98.04 33.53,98.04 35.94,96.9 35.94,100.97 39.12,102.49 42.04,99.82 41.78,102.87 36.83,105.92 11.3,99.82 12.83,101.47 6.6,102.74 9.91,102.74 8.51,99.82 13.21,94.74 13.21,92.96 13.34,90.93 9.91,90.04 12.06,89.41 7.62,90.17 6.99,92.33 7.37,95 5.33,97.54 5.33,92.46 2.79,95 2.79,98.3 2.79,91.44 1.27,92.71 1.27,97.03 3.94,100.97 4.95,103.5 2.79,89.41 5.46,88.77 5.59,85.6 8.89,85.09 11.94,87.38 10.92,85.22 14.48,86.87 22.1,86.23 22.1,84.84 19.56,84.84 29.72,86.23 29.72,84.71 31.75,87.38 0.89,84.45 3.05,82.68 3.05,77.85 4.95,79.38 8.64,79.5 11.05,79.5 12.7,80.14 15.37,80.01 14.86,77.85 9.27,77.34 11.56,76.71 18.29,79.88 6.99,82.42 11.18,82.68 0.89,79.76 1.02,76.07 0.89,72.01 3.05,74.04 3.05,71.88 4.57,70.61 0.89,66.17 0.89,63.88 1.27,59.69 2.03,57.28 3.43,60.58 3.43,64.01 4.45,57.91 7.75,57.91 7.75,60.45 10.92,74.3 15.11,74.3 10.92,69.72 12.32,65.02 14.22,63.12 15.11,66.67 13.08,68.45 13.84,71.75 18.16,74.3 18.16,70.87 18.16,67.06 18.16,63.25 23.75,63.25 26.67,66.29 21.46,65.66 20.7,72.52 23.88,74.42 27.56,74.55 29.21,68.83 31.11,70.87 31.24,73.28 29.46,71.88 30.23,76.33 25.91,76.45 18.29,76.58 28.83,79.63 23.5,80.01 21.46,77.72 33.4,80.26 38.48,78.11 31.5,82.42 37.08,82.42 41.27,82.55 41.78,74.55 38.48,73.91 36.45,76.33 36.2,71.37 36.32,66.04 38.73,66.04 37.59,68.96 41.78,66.67 41.78,70.61 10.92,62.87 11.94,62.1 12.83,60.33 14.99,60.33 18.29,60.2 20.19,59.94 23.88,59.82 26.42,59.94 27.81,58.67 25.78,58.67 17.14,58.55 15.37,58.42 13.72,58.67 11.3,58.29 9.4,59.44 9.4,57.15 9.4,54.48 11.3,55.24 11.18,53.59 13.72,53.85 18.8,53.85 21.34,53.85 30.1,56.01 27.05,63.25 31.24,59.94 34.42,60.07 30.23,62.36 30.99,67.31 29.59,65.02 37.72,61.59 39.62,61.21 42.55,61.59 39.62,59.69 40.13,54.23 41.91,53.85 43.31,52.7 38.1,54.23 35.31,54.48 34.04,53.47 36.58,53.47 6.99,54.74 6.1,53.59 6.1,51.05 10.03,50.16 13.84,50.42 3.05,54.36 1.27,52.96 0.89,49.91 0.89,48.13 0.89,45.47 4.32,46.23 6.73,48.26 14.61,48.51 17.4,48.39 22.73,47.62 21.08,48.77 17.53,46.23 19.68,46.35 22.1,45.85 22.1,44.07 14.61,44.32 8.64,44.2 3.43,51.31 3.05,47.88 0.89,42.16 0.89,37.97 5.97,43.94 6.1,41.02 11.18,40.64 14.73,38.35 12.19,38.35 13.72,37.34 3.3,40.89 3.3,38.23 5.97,38.1 15.11,41.91 22.73,42.55 26.8,45.97 22.1,50.16 19.18,50.42 25.78,41.66 27.18,43.31 29.08,45.09 29.21,41.66 28.96,43.31 27.56,41.78 29.21,47.88 26.16,51.05 31.24,51.44 28.96,50.42 30.61,46.48 32.77,47.62 32.26,45.09 34.42,51.05 35.31,48.9 37.85,50.8 36.58,41.02 35.43,42.29 35.43,45.85 37.85,45.85 37.85,42.29 40.13,47.75 40.13,44.7 40.13,46.23 40.13,51.18 39.12,38.61 42.93,39.24 37.21,36.2 35.43,38.23 36.58,37.72 33.4,37.47 30.35,36.96 27.43,37.21 28.7,37.21 28.07,35.56 30.73,34.67 33.53,34.8 35.18,35.94 38.99,34.67 39.5,32.89 33.4,31.24 32.26,33.27 33.66,28.7 30.1,28.45 30.1,26.29 32.77,25.91 31.37,27.18 35.69,25.65 38.35,25.78 39.62,26.8 41.66,26.16 21.46,36.2 21.46,34.42 24.26,37.47 21.97,38.23 19.3,38.1 17.14,38.23 10.54,36.58 9.78,35.18 12.57,34.67 14.35,35.43 16.38,35.18 16,37.08 7.62,36.32 4.95,33.53 6.6,35.18 3.43,32 7.75,32 9.91,29.97 10.79,32.51 12.57,32.38 13.84,32.64 16.51,30.1 19.43,31.75 18.29,28.07 17.02,26.92 13.84,27.94 12.19,28.07 1.14,33.66 2.92,36.32 10.03,47.12 11.56,47.12 21.59,31.75 23.37,31.75 25.15,34.29 26.67,34.29 26.67,32.77 28.7,34.54 27.81,31.75 29.59,31.24 13.59,26.29 15.24,25.4 18.16,25.65 13.72,22.86 11.43,25.53 12.45,21.21 15.11,21.21 16.51,22.86 18.16,21.34 20.07,19.94 20.95,23.75 3.43,27.69 6.48,25.78 4.95,26.67 9.27,26.04 8.64,30.73 23.88,27.56 27.69,27.56 27.69,25.78 27.69,24 23.88,25.78 27.81,21.97 23.88,20.07 25.4,18.54 27.81,20.57 21.46,25.91 21.84,27.81 21.21,29.08 25.65,28.07 25.78,24.89 37.08,24.51 35.56,23.88 33.66,23.62 30.1,23.62 29.59,21.59 33.66,21.84 35.31,22.35 36.96,21.59 38.99,21.72 40.26,24.38 41.53,21.84 40.64,20.45 42.93,20.07 43.43,19.05 43.31,21.34 43.31,16.26 43.31,14.48 41.15,13.21 37.97,14.86 37.97,17.02 37.97,12.7 39.37,11.81 41.53,11.94 41.53,17.14 36.58,18.8 33.66,16.51 28.7,17.27 32.26,14.35 33.53,14.99 33.66,13.46 29.21,14.48 27.81,14.99 28.32,13.34 25.02,13.34 26.54,11.68 21.34,13.21 24,10.41 23.37,12.06 24.89,14.99 22.1,14.99 21.59,17.27 18.16,15.24 19.94,16 19.43,17.53 16.51,17.02 15.24,18.54 14.35,15.62 8.64,20.45 8.26,18.92 4.19,24.38 1.02,21.97 0.89,19.18 0.89,16.76 5.97,16.64 10.03,12.83 8.38,14.35 5.46,14.48 2.67,14.48 1.02,15.24 0.89,12.45 4.19,12.45 6.6,11.43 3.3,6.86 6.6,7.87 10.29,7.87 9.53,5.33 4.06,4.06 9.02,2.92 4.83,2.16 10.16,1.02 2.79,1.02 7.37,1.52 13.59,3.05 16.64,1.14 23.24,1.02 22.73,4.95 21.97,3.43 24,2.92 19.94,1.14 17.78,6.1 19.56,3.3 16.26,3.3 13.46,9.53 11.94,14.35 13.08,12.95 15.62,13.34 5.84,21.08 6.35,23.11 9.27,22.86 14.61,11.56 16.51,11.68 18.41,12.32 17.65,9.65 21.72,6.86 23.37,8.38 17.91,4.83 25.65,2.92 27.43,2.92 29.08,5.08 29.21,1.27 33.4,4.7 35.81,8 34.04,1.27 39.12,1.27 31.24,3.17 33.78,6.48 37.08,9.91 41.53,10.16 39.24,8.26 41.66,8.13 40.39,4.83 41.78,4.19 39.24,9.91 29.08,9.14 30.1,7.49 31.88,7.62 30.48,11.94 32,10.41 30.48,10.41 22.35,107.31
  pour Top (isolate 0.305): 0,108.71 44.2,108.71 44.2,0 0,0
  pour Bottom (isolate 0.305): 0,108.71 44.2,108.71 44.2,0 0,0
GSM_PWR_EN  (via drill 0.3)
  Top 0.152: v9.91,79.63 10.03,79.5 10.03,52.7 N1.3
  Bottom 0.152: 9.91,84.33 U7.2 | 9.91,84.33 v9.91,79.63 | R3.1 7.37,84.84 8.13,84.07 9.65,84.07 9.91,84.33
GSM_PWR_KEY
  Bottom 0.152: N1.9 26.47,53.9 32.89,53.9 35.28,56.29 U6.P$13
GSM_RING
  Bottom 0.152: N1.8 24.23,54.2 32.77,54.2 35.5,56.94 U6.P$14
GSM_RXD
  Bottom 0.152: U6.P$16 38.08,58.24 39.29,57.02 39.29,40 38.23,38.94 36.25,38.94 N1.18
GSM_STATUS
  Bottom 0.152: N1.10 28.7,53.59 33.02,53.59 35.06,55.64 U6.P$12
GSM_TXD
  Bottom 0.152: U6.P$15 38.3,57.59 38.99,56.9 38.99,41.02 N1.17
I2C_SCL  (via drill 0.3)
  Top 0.152: v33.02,18.41 27.3,18.41 20.19,25.53 v20.19,37.47 | v17.02,41.78 16.38,42.42 16.38,84.96 J3.CLK
  Bottom 0.152: U12.32 17.17,32.79 17.4,33.02 17.4,33.38 R10.1 17.54,33.54 18.54,34.54 18.54,35.81 v20.19,37.47 N1.23 | U3.19 10.29,43.68 12.8,41.18 17.62,41.18 | N1.23 21.31,41.18 17.62,41.18 | U4.19 23.38,34.03 22.61,34.8 N1.23 | U5.19 35.31,10.68 35.69,11.05 35.69,16.13 33.4,18.41 v33.02,18.41 | 17.62,41.18 v17.02,41.78
I2C_SDA  (via drill 0.3)
  Top 0.152: 20.95,37.97 20.07,38.86 N1.24 19.05,40.89 16.89,40.89 16.08,41.71 16.08,82.73 J3.DATA | 20.95,37.97 22.48,36.45 v23.24,36.45 | v32.38,18.97 27.18,18.97 20.5,25.65 20.5,36.5 20.95,36.96 20.95,37.97
  Bottom 0.152: U12.31 16.37,34.13 R20.1 17.54,37.35 N1.24 19.07,40.87 12.67,40.87 9.79,43.75 U3.20 | U4.20 23.31,34.53 22.91,34.92 22.91,36.07 23.24,36.4 v23.24,36.45 | U5.20 35.24,10.18 35.99,10.92 35.99,16.61 33.63,18.97 v32.38,18.97
MICROSD_CS  (via drill 0.3)
  Top 0.152: N1.21 29.23,38.33 31.47,38.33 v31.75,38.61 | v36.96,28.45 38.27,27.13 38.84,27.13 39.77,28.07 v39.88,28.07
  Bottom 0.152: v36.96,28.45 36.96,35 33.35,38.61 v31.75,38.61 | v39.88,28.07 40.26,28.07 40.39,28.19 41.03,28.19 J4.DAT3/CS
N$1  (via drill 0.3)
  Top 0.152: v22.73,48.9 22.79,48.9 B13.4
  Bottom 0.152: U3.10 11.79,49.01 12.45,49.66 21.34,49.66 22.1,48.9 v22.73,48.9
N$2  (via drill 0.3)
  Top 0.152: v18.03,44.2 18.09,44.2 B13.1
  Bottom 0.152: U3.12 14.89,46.85 17.68,44.07 17.91,44.07 v18.03,44.2
N$3  (via drill 0.3)
  Top 0.152: v18.92,43.05 B13.2
  Bottom 0.152: U3.13 14.96,46.35 18.26,43.05 v18.92,43.05
N$4  (via drill 0.3)
  Top 0.152: v19.94,42.04 20.68,42.78 B13.3
  Bottom 0.152: U3.14 15.03,45.85 18.85,42.04 v19.94,42.04
N$5  (via drill 0.3)
  Top 0.152: v24.77,46.74 25.49,47.46 B13.6
  Bottom 0.152: U3.11 19.83,47.35 20.45,46.74 v24.77,46.74
N$6  (via drill 0.3)
  Top 0.152: v31.24,48.51 32.07,49.34 B14.2
  Bottom 0.152: U3.15 15.1,45.35 18.97,41.48 24.21,41.48 v31.24,48.51
N$7  (via drill 0.3)
  Top 0.152: v11.3,49.4 11.43,49.53 B16.2
  Bottom 0.152: U3.9 v11.29,49.4 v11.3,49.4
N$8  (via drill 0.3)
  Top 0.152: v12.06,43.81 12.06,42.99 B17.1
  Bottom 0.152: U3.16 11.79,44.09 v12.06,43.81
N$9  (via drill 0.3)
  Top 0.152: B15.1 31.62,42.48 v31.62,42.04
  Bottom 0.152: v31.62,42.04 31.37,41.78 31.37,39.5 29.46,37.59 29.46,34.16 28.33,33.03 U4.9
N$10  (via drill 0.3)
  Top 0.152: v30.02,35.69 29.39,36.32 B9.1
  Bottom 0.152: U4.10 28.26,32.53 29.77,34.04 29.77,35.48 29.97,35.69 v30.02,35.69
N$11  (via drill 0.3)
  Top 0.152: v32,34.67 32,36.26 B5.1
  Bottom 0.152: U4.11 26.91,31.26 27.18,30.99 28.32,30.99 v32,34.67
N$12  (via drill 0.3)
  Top 0.152: v28.45,30.43 31.35,30.43 B1.1
  Bottom 0.152: U4.12 26.41,31.33 27.05,30.68 28.2,30.68 v28.45,30.43
N$13  (via drill 0.3)
  Top 0.152: v25.91,30.86 25.91,29.91 B10.1
  Bottom 0.152: U4.13 v25.91,30.86
N$14  (via drill 0.3)
  Top 0.152: B6.1 12.13,23.56 v15.88,27.3
  Bottom 0.152: U4.14 25.41,31.25 24.77,30.61 19.18,30.61 v15.88,27.3
N$15  (via drill 0.3)
  Top 0.152: B2.1 12.13,29.4 12.95,28.57 v15.62,28.57
  Bottom 0.152: U4.15 24.91,31.18 24.64,30.91 19.05,30.91 16.71,28.57 v15.62,28.57
N$16  (via drill 0.3)
  Top 0.152: v18.56,32.53 15.73,32.53 12.13,36.13 B11.1
  Bottom 0.152: U4.16 v18.56,32.53 18.54,32.51
N$17  (via drill 0.3)
  Top 0.152: v13.46,14.22 12.13,15.56 B3.1
  Bottom 0.152: U5.9 28.02,11.68 25.48,14.22 v13.46,14.22
N$18  (via drill 0.3)
  Top 0.152: v26.16,14.73 26.16,16.45 B4.1
  Bottom 0.152: U5.10 27.96,12.18 26.16,13.97 v26.16,14.73
N$19  (via drill 0.3)
  Top 0.152: v30.23,22.35 29.46,23.11 B7.1
  Bottom 0.152: U5.11 30.24,22.34 v30.23,22.35
N$20  (via drill 0.3)
  Top 0.152: v31.24,21.84 32.07,22.67 B8.1
  Bottom 0.152: U5.12 30.74,21.34 v31.24,21.84
N$21  (via drill 0.3)
  Top 0.152: v31.37,15.49 32.07,16.19 B12.1
  Bottom 0.152: U5.13 31.24,15.37 v31.37,15.49
N$22  (via drill 0.3)
  Top 0.152: v41.02,61.98 41.02,60.83 v41.66,60.2
  Bottom 0.152: 41.02,62.36 v41.02,61.98 | 41.02,62.36 C1.2 | v41.66,60.2 41.67,60.19 U6.P$2 | U6.P$10 42.04,54.99 41.78,54.74 41.02,54.74 40.64,55.12 40.64,61.98 41.02,62.36
  Bottom 0.406: U1.P$15 26.57,75.34 30.35,79.12 35.69,79.12 36.7,78.11 39.88,74.93 39.88,63.37 40.75,62.5 C1.2
N$23  (via drill 0.3)
  Top 0.152: v41.4,55.5 v32.38,55.5
  Bottom 0.152: U6.P$9 41.54,55.64 v41.4,55.5 | U1.P$66 14.57,58.52 17.09,61.04 26.85,61.04 v32.38,55.5
N$24  (via drill 0.3)
  Top 0.152: v41.4,56.31 v32.89,56.31
  Bottom 0.152: U6.P$8 41.43,56.29 41.4,56.26 v41.4,56.31 | v32.89,56.31 32,56.31 26.97,61.34 12.45,61.34 11.43,60.33 9.78,60.33 8.76,61.34 U1.P$1
N$25  (via drill 0.3)
  Top 0.152: v41.4,57.15 v33.4,57.15
  Bottom 0.152: U6.P$7 41.62,56.94 v41.4,57.15 | v33.4,57.15 31.6,57.15 27.1,61.65 13.54,61.65 10.84,64.34 U1.P$4
N$26  (via drill 0.3)
  Top 0.152: v41.4,58.04 v33.91,58.04
  Bottom 0.152: U6.P$6 41.85,57.59 v41.4,58.04 | v33.91,58.04 31.14,58.04 27.23,61.95 13.66,61.95 11.05,64.57 11.05,67.69 9.4,69.34 U1.P$9
N$27  (via drill 0.3)
  Top 0.152: v41.4,58.93 v34.42,58.93
  Bottom 0.152: U6.P$5 42.09,58.24 v41.4,58.93 | v34.42,58.93 30.68,58.93 27.35,62.26 13.79,62.26 11.35,64.69 11.35,68.02 9.03,70.34 U1.P$10
N$28
  Bottom 0.152: U2.P$1 9.96,91.24 8.96,90.24 U7.4
N$29
  Bottom 0.406: R5.2 R4.1 9.96,100.42 U2.P$5
N$30
  Bottom 0.152: U6.P$17 38.31,58.89 38.73,59.31 38.73,60.07 | 38.73,61.47 38.73,60.07 | 38.73,61.47 R1.2 | U6.P$18 38.2,59.54 38.73,60.07 | U6.P$20 38.1,60.84 38.73,61.47
N$31  (via drill 0.3)
  Top 0.152: v23.62,106.55 23.64,106.53 U8.C1
  Top 0.254: v24.51,83.82 24.51,86.11 24.13,86.49 24.21,86.49 v24.26,86.44 | v24.13,88.52 24.13,105.43 U8.C1
  Bottom 0.152: U9.P$6 13.73,107.71 13.97,107.95 22.99,107.95 23.62,107.31 v23.62,106.55 23.62,105.79 22.86,105.03 22.59,105.03 C10.1
  Bottom 0.254: U1.P$30 24.57,83.76 v24.51,83.82 | v24.26,86.44 24.38,86.57 24.38,88.27 v24.13,88.52
N$32
  Bottom 0.152: 42.7,59.64 U6.P$3 | R2.2 42.56,62.5 41.78,61.72 | 41.78,61.72 41.1,61.04 41.1,59.97 41.53,59.54 U6.P$3 | U6.P$4 U6.P$3 | U6.P$1 41.78,60.84 41.66,60.96 41.66,61.59 41.78,61.72
N$33  (via drill 0.3)
  Top 0.152: v17.02,107.31 17.02,106.19 U8.C7
  Bottom 0.152: U9.P$5 13.08,106.69 13.44,106.34 16.29,106.34 16.51,106.55 16.78,106.55 R9.1 v17.02,107.31
N$34  (via drill 0.3)
  Top 0.152: v18.8,107.31 18.8,106.15 U8.C3
  Bottom 0.152: U9.P$4 12.43,106.57 12.97,106.03 17.77,106.03 18.29,106.55 18.56,106.55 R8.1 v18.8,107.31
N$35
  Bottom 0.152: U12.15 6.41,24.05 R11.1 5.45,25.02 3,25.02 X2.1 1.54,24.37 C34.2
N$36  (via drill 0.3)
  Top 0.152: v20.83,107.31 20.83,106.19 U8.C2
  Bottom 0.152: U9.P$3 12.43,104.89 12.79,105.25 13.27,105.73 19.24,105.73 20.07,106.55 20.34,106.55 R7.1 20.83,107.05 v20.83,107.31
N$37
  Bottom 0.152: R7.2 20.94,104.79 21.08,104.65 21.08,103.52 C9.2 21.34,103.23 21.34,102.49 22,101.83 24.38,101.83 25.42,100.79 25.42,88.8 27.36,86.87 27.36,85.04 27.57,84.82 U1.P$33
N$38
  Bottom 0.152: R8.2 18.56,104.79 18.18,104.41 C8.2 18.16,103.23 18.16,102.49 19.13,101.52 24.26,101.52 25.12,100.66 25.12,88.67 27.05,86.74 27.05,85.09 26.57,84.61 U1.P$32
N$39
  Bottom 0.152: U1.P$31 25.57,84.28 24.81,85.04 24.81,100.54 24.13,101.22 18.29,101.22 17,102.5 C7.2 17,104.78 R9.2
N$40
  Bottom 0.152: 6.35,22.45 U12.13 | 6.35,22.45 4.34,22.45 X2.3 3.54,21.66 C33.2 | R11.2 6.35,22.45
N$41
  Bottom 0.406: U11.5 4.02,74.07 L1.2
N$42
  Bottom 0.152: U12.10 10.77,18.55 11.87,17.45 | 11.87,17.45 C39.1 | R13.2 10.03,15.62 11.87,17.45
N$43  (via drill 0.3)
  Top 0.152: v36.58,93.6 29.97,87 v19.94,87
  Bottom 0.152: C14.2 36.97,97.95 C12.2 C11.2 36.97,96.11 | 36.97,96.11 C15.2 36.97,94 v36.58,93.6 | J1.- 37.77,96.9 36.97,96.11 | U1.P$22 16.57,84.14 17.14,84.71 17.14,85.98 18.16,87 v19.94,87
N$44  (via drill 0.3)
  Top 0.152: v20.7,87.63 21.03,87.3 29.85,87.3 35.31,92.76 v35.31,93.6
  Bottom 0.152: C13.2 34.91,97.95 C12.1 C11.1 | C11.1 34.94,94.39 C16.2 34.91,94 v35.31,93.6 | J1.+ 34.18,96.9 C11.1 | U1.P$21 15.57,83.57 16.84,84.83 16.84,85.98 16.84,86.11 18.29,87.55 19.81,87.55 19.94,87.55 20.62,87.55 v20.7,87.63
N$45
  Bottom 0.152: U12.11 9.97,17.45 C39.2 9.91,17.38 R12.1
N$46
  Bottom 0.152: C41.2 R15.2
N$47  (via drill 0.3)
  Top 0.152: v1.52,36.2 1.52,34.9 1.93,34.49 2.29,34.49 9.5,27.28 9.98,26.8 9.98,21.59 17.91,13.67 v17.91,13.21 | v19.68,13.21 24.1,8.79 J2.+
  Bottom 0.152: 25.65,8.51 C21.2 | C17.2 25.65,8.51 | C17.2 C18.2 C20.2 27.42,8.51 25.65,8.51 | J2.+ 24.37,7.22 C17.2 | U1.P$19 13.57,79.36 12.75,78.54 11.05,78.54 5.97,78.54 5.82,78.38 5.28,77.85 5.28,75.56 5.28,54.99 3.85,53.56 1.85,51.56 1.85,37.08 1.85,36.52 v1.52,36.2 | v17.91,13.21 v19.68,13.21
N$48  (via drill 0.3)
  Top 0.152: v2.16,35.05 10.29,26.92 10.29,21.72 22.61,9.4 22.61,6.48 24.1,4.99 J2.-
  Bottom 0.152: J2.- 24.37,5.22 C17.1 | C17.1 C18.1 C19.2 C22.2 C17.1 | U1.P$20 14.57,79.09 13.72,78.23 6.1,78.23 5.59,77.72 5.59,54.86 2.16,51.44 v2.16,35.05
N$49
  Bottom 0.152: R15.1 C40.2 6.84,21.07 7.43,21.65 U12.12
N$50
  Bottom 0.152: C43.2 R18.1 26.8,23 U13.P$8
N$51
  Bottom 0.152: C44.2 R19.2 22.99,23 U13.P$5
N$52
  Bottom 0.152: R16.1 C44.1
N$53
  Bottom 0.152: R17.1 C43.1
N$54  (via drill 0.3)
  Top 0.152: v21.08,8.13 16.89,12.32 v13.84,12.32
  Bottom 0.152: U14.1 20.56,7.1 21.08,7.62 v21.08,8.13 | v13.84,12.32 C49.2
N$55
  Bottom 0.152: U14.9 5.16,6.6 C50.2
N$56
  Bottom 0.152: U14.3 21.34,6.1 21.84,5.59 21.84,4.83 20.83,3.81 20.83,3.57 C51.2
N$57
  Bottom 0.152: J5.3 1.7,9.47 C50.1
N$58
  Bottom 0.152: U14.2 19.31,6.6 18.92,6.99 18.92,8 19.57,8.65 C52.2
N$59
  Bottom 0.152: U14.8 16.51,6.1 17.78,7.37 C53.2
N$60
  Bottom 0.152: J5.2 8.86,12.32 C49.1
N$61  (via drill 0.3)
  Top 0.406: v21.84,59.69 30.48,68.33 J6.P$3
  Bottom 0.406: U1.P$60 20.57,58.42 v21.84,59.69
N$62
  Bottom 0.254: U16.4 U15.3
N$63
  Top 0.152: D1.1 R21.2
N$64
  Top 0.152: D2.1 R24.2
N$65  (via drill 0.3)
  Top 0.152: N1.19 30.53,42.11 30.53,45.21 24.38,51.36 17.28,51.36 v17.14,51.23 | v15.49,51.31 15.44,51.36 9.47,51.36 8.76,52.07 8.76,64.88 R24.1
  Bottom 0.152: v17.14,51.23 16.97,51.05 15.75,51.05 v15.49,51.31
N$66  (via drill 0.3)
  Top 0.152: N1.20 30.23,45.09 24.26,51.05 17.91,51.05 v17.27,50.42 | v15.37,50.42 14.73,51.05 9.35,51.05 8.46,51.94 8.46,64.75 7.93,65.28 R21.1
  Bottom 0.152: v17.27,50.42 v15.37,50.42
SPI_MISO  (via drill 0.3)
  Top 0.152: N1.32 41.66,47.5 41.66,34.42 v42.16,33.91
  Bottom 0.152: v42.16,33.91 41.25,33.91 J4.DAT0/DO
SPI_MOSI
  Bottom 0.152: N1.31 41.53,49.91 41.53,39.12 37.59,35.18 37.59,31.11 | 37.59,31.11 39.23,29.48 J4.CMD/DI | 37.59,31.11 37.59,27.48 36.96,26.85 34.16,26.85 31.33,29.68 19.8,29.68 U12.34
SPI_SCK  (via drill 0.3)
  Top 0.152: v38.61,27.69 v38.61,32.13
  Bottom 0.152: N1.33 41.83,45.14 41.83,38.99 37.9,35.05 37.9,32.84 v38.61,32.13 39.06,31.68 J4.CLK/SCK | U12.36 21.06,28.05 22.38,29.38 31.2,29.38 34.04,26.54 37.47,26.54 v38.61,27.69
STA013_BIT_EN  (via drill 0.3)
  Top 0.152: v18.29,26.92 13.46,31.75 9.65,31.75 8.13,33.27 8.13,35.56 N1.27
  Bottom 0.152: U12.38 18.76,26.45 v18.29,26.92
STA013_DREQ
  Bottom 0.152: N1.25 13.17,35.52 U12.27
STA013_LRCKT
  Bottom 0.152: U12.2 17.17,19.15 17.65,18.67 22.48,18.67 24.26,16.89 U13.P$3
STA013_OCLK
  Bottom 0.152: U12.3 16.37,19.06 17.07,18.36 21.77,18.36 22.99,17.14 U13.P$4
STA013_SCKT
  Bottom 0.152: U12.44 20.76,21.65 25.53,16.89 U13.P$2
STA013_SDO
  Bottom 0.152: U12.42 20.56,23.25 21.08,22.73 21.08,21.77 25.2,17.65 26.04,17.65 26.8,16.89 U13.P$1
VBAT  (via drill 0.3)
  Top 0.406: v4.32,59.18 S1.2
  Bottom 0.406: BAT[+-].1 4.34,68.94 4.34,62.21 4.32,62.19 v4.32,59.18
VIBRATOR_EN  (via drill 0.3)
  Top 0.152: v34.57,19.96 34.57,38.96 34.27,39.27 34.27,49.28 37.57,52.58 N1.14
  Top 0.254: v38.72,18.02 42.91,18.02 v42.93,18.03
  Bottom 0.152: R23.1 36.16,18.02 34.54,19.64 34.54,19.94 v34.57,19.96
  Bottom 0.254: R23.1 v38.72,18.02 38.73,18.03 | v42.93,18.03 U16.2
VIN  (via drill 0.3)
  Top 0.406: v4.45,56.77 4.53,56.68 S1.3
  Bottom 0.406: v4.45,56.77 2.41,58.8 2.41,60.83 1.27,61.98 1.27,63.12 2.41,64.26 2.41,71.52 C25.1 L1.1 2.07,74.07 U11.8 U11.1

### Text on the board
tPlace: SPK | uSIM | BAT | - | + | ANT | 1k | 1k | AUDIO | MIC
bPlace: ESDA | 51R | 100nF | 100k | 47k | 22pF | 33pF | 33pF | 100nF | 10pF | 33pF | 470R | 10pF | 10pF | 1uF | 10uF | 100uF | MIC29302 | 74125 | 10uF | 10k | MCP1642B | 4.7uH | 10uF | SIM5300EA | 10k | 10k | 100nF | TXB0108 | 100nF | MCP23008 | 100nF | 100nF | MicroSD | ioNode | 10k | 100nF | 10k | 10k | STA013 | 100nF | MCP23008 | 3.3nF | 560R | 27pF | 3.3uF | 1M | 100nF | 270k | CS4334 | 1uF | 10uF | 100nF | 1uF | 3.3V | 27pF | 470pF | 10uF | 4.7nF | 1k | 4.7R | 74125 | 10k | 100nF | 100uF | 100nF | 2.7V | 33pF | 1uF | 1uF | 1uF | 10pF | 1uF | 100k | LM4811 | 10pF | MCP23008 | 100uF | 33pF | 10pF | 33pF | 1uF | 1uF | VIBRATION MOTOR